# Altium project Pin Swapping - Brendan Cook.PrjPcb (part 1 of 2)
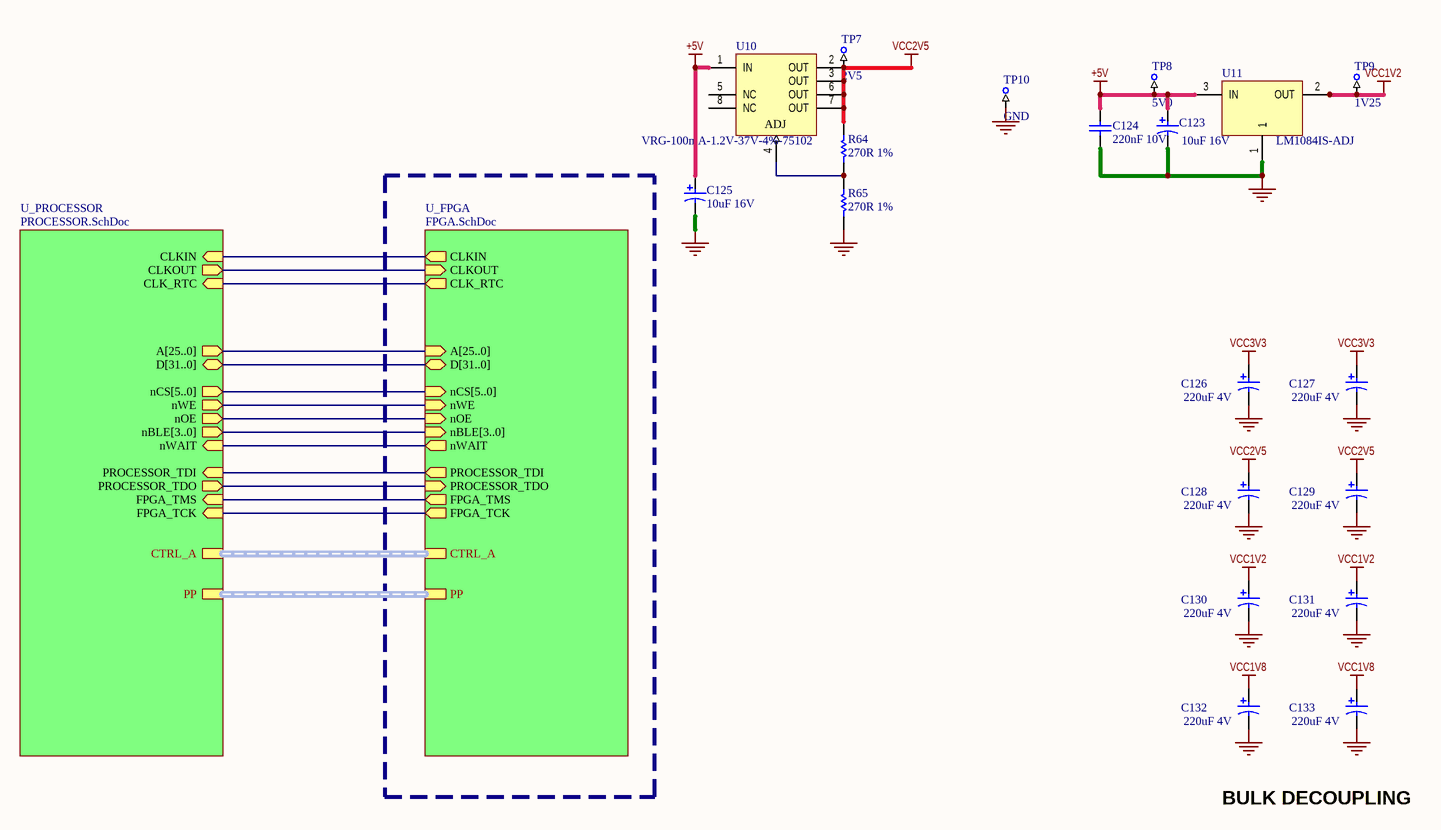
[diagram p0: TOP_SHEET.SchDoc]
5 sheets, 230 parts. Net scope: hierarchical (ports join the sheet entries above them; power ports are global).
Board file: NBP-28 Pin_Swap_Example.PcbDoc
Sheets:
  TOP_SHEET.SchDoc
    U_PROCESSOR = PROCESSOR.SchDoc
      U_PROCESSOR_MEMORIES = PROCESSOR_MEMORIES.SchDoc
    U_FPGA = FPGA.SchDoc
      U_FPGA_RAM = FPGA_MEMORIES.SchDoc

## Sheet TOP_SHEET.SchDoc: Pin Swapping
size 431 x 279 mm; DocumentNumber: 1; SheetNumber: 1; SheetTotal: 5

### Parts
C123  10uF 16V  [CAPC3528]
C124  220nF 10V  [CAPC1608]
C125  10uF 16V  [CAPC3528]
C126  220uF 4V  [CAPC7343]
C127  220uF 4V  [CAPC7343]
C128  220uF 4V  [CAPC7343]
C129  220uF 4V  [CAPC7343]
C130  220uF 4V  [CAPC7343]
C131  220uF 4V  [CAPC7343]
C132  220uF 4V  [CAPC7343]
C133  220uF 4V  [CAPC7343]
R64  270R 1%  [RESC2012]
R65  270R 1%  [RESC2012]
TP7  2V5  [TestPin]  (no BOM)
TP8  5V0  [TestPin]  (no BOM)
TP9  1V25  [TestPin]  (no BOM)
TP10  GND  [TestPin]  (no BOM)
U10  VRG-100mA-1.2V-37V-4%-75102  [SOP127P600-8]
U11  LM1084IS-ADJ  [TO254P1435-4]

### Sub-sheets
U_FPGA = FPGA.SchDoc: FPGA_TMS (out), FPGA_TCK (out), PROCESSOR_TDO (in), PROCESSOR_TDI (out), CLKIN (out), A[25..0] (in), D[31..0] (bidir), nBLE[3..0] (in), nWE (in), nOE (in), nCS[5..0] (in), nWAIT (out), CLKOUT (in), CLK_RTC (out), PP (harness PP_13_LINES), CTRL_A (harness P_C_HARNESS)
U_PROCESSOR = PROCESSOR.SchDoc: A[25..0] (out), D[31..0] (bidir), CLKOUT (out), PROCESSOR_TDO (out), PROCESSOR_TDI (in), nBLE[3..0] (out), nWE (out), nOE (out), nCS[5..0] (out), nWAIT (in), CLKIN (in), FPGA_TMS (in), FPGA_TCK (in), CLK_RTC (in), PP (harness PP_13_LINES), CTRL_A (harness P_C_HARNESS)

### Nets
+5V: C123.1 C124.1 C125.1 TP8.1 U10.1(IN) U11.3(IN)
GND: C123.2 C124.2 C125.2 C126.2 C127.2 C128.2 C129.2 C130.2 C131.2 C132.2 C133.2 R65.2 TP10.1 U11.1
VCC1V2: C130.1 C131.1 TP9.1 U11.2(OUT) U11.4(HeatSink)
VCC1V8: C132.1 C133.1
VCC2V5: C128.1 C129.1 R64.1 TP7.1 U10.2(OUT) U10.3(OUT) U10.6(OUT) U10.7(OUT)
VCC3V3: C126.1 C127.1
CLK_RTC: sheet U_PROCESSOR/CLK_RTC, sheet U_FPGA/CLK_RTC
CLKIN: sheet U_PROCESSOR/CLKIN, sheet U_FPGA/CLKIN
CLKOUT: sheet U_PROCESSOR/CLKOUT, sheet U_FPGA/CLKOUT
FPGA_TCK: sheet U_PROCESSOR/FPGA_TCK, sheet U_FPGA/FPGA_TCK
FPGA_TMS: sheet U_PROCESSOR/FPGA_TMS, sheet U_FPGA/FPGA_TMS
nOE: sheet U_PROCESSOR/nOE, sheet U_FPGA/nOE
nWAIT: sheet U_PROCESSOR/nWAIT, sheet U_FPGA/nWAIT
nWE: sheet U_PROCESSOR/nWE, sheet U_FPGA/nWE
PROCESSOR_TDI: sheet U_PROCESSOR/PROCESSOR_TDI, sheet U_FPGA/PROCESSOR_TDI
PROCESSOR_TDO: sheet U_PROCESSOR/PROCESSOR_TDO, sheet U_FPGA/PROCESSOR_TDO
NetR64_2: R64.2 R65.1 U10.4(ADJ)

Not connected (* = marked no-connect by the designer): U10 5(NC) 8(NC)

### Buses and harness runs
bus sheet U_FPGA/A[25..0] = sheet U_PROCESSOR/A[25..0]
bus sheet U_FPGA/D[31..0] = sheet U_PROCESSOR/D[31..0]
bus sheet U_FPGA/nBLE[3..0] = sheet U_PROCESSOR/nBLE[3..0]
bus sheet U_FPGA/nCS[5..0] = sheet U_PROCESSOR/nCS[5..0]
harness sheet U_FPGA/CTRL_A = sheet U_PROCESSOR/CTRL_A
harness sheet U_FPGA/PP = sheet U_PROCESSOR/PP

### Notes on the sheet
- BULK DECOUPLING
- 8
- 7
- 6
- 5
- 4
- 3
- DWG. NO.
- REV.
- SHT.
- 2
- 1
- THIS DOCUMENT AND THE DATA DISCLOSED HEREIN OR HEREWITH IS THE PROPERTY OF ALTIUM LIMITED AND MAY BE FREELY DISTRIBUTED IN WHOLE. NO RIGHTS ARE RESERVED OR EXPRESS OR IMPLIED WARANTEE GIVEN.
- REVISION
- DESCRIPTION
- DATE
- APPROVED
- F
- E
- D
- C
- B
- ENG:
- APPROVALS
- PROJECT
- A
- DSN:
- CHK:
- REFERENCE DOCUMENTS
- PROJECT REVISION:
- TITLE
- DOCUMENT REVISION:
- DESIGN ITEM:
- BOM:
- FAB DWG:
- PCB DWG:
- ASSY DWG:
- SCALE:
- SIZE
- CAGE CODE
- FILE NAME
- DWG NO.
- SHEET
- OF
- REV

### Library data of the parts
C123 C125-C133 = CAP-P: Polar Capacitor
  C123 C125: Design Item Id: CAP-P-10uF-16V-MCCT-B
  C126-C133: Design Item Id: CAP-P-220uF-4V-MCCT-D
C124 = CAP-NP: Capacitor; Design Item Id: CAP-NP-220nF-10V-0603
R64 R65 = RES: Resistor; Design Item Id: RES-270R-1%-0805
TP7-TP10 = TestPin: Design Item Id: TestPin
U10 = VRG-ADJ-8: Low Current 3-Terminal Adjustable Positive Voltage Regulator; Design Item Id: VRG-100mA-1.2V-37V-4%-75102
U11 = VRG-ADJ-3: 5A Low Dropout Positive Regulators; Design Item Id: LM1084IS-ADJ

## Sheet PROCESSOR.SchDoc: Pin Swapping
size 558 x 431 mm; DocumentNumber: 2; SheetNumber: 2; SheetTotal: 6
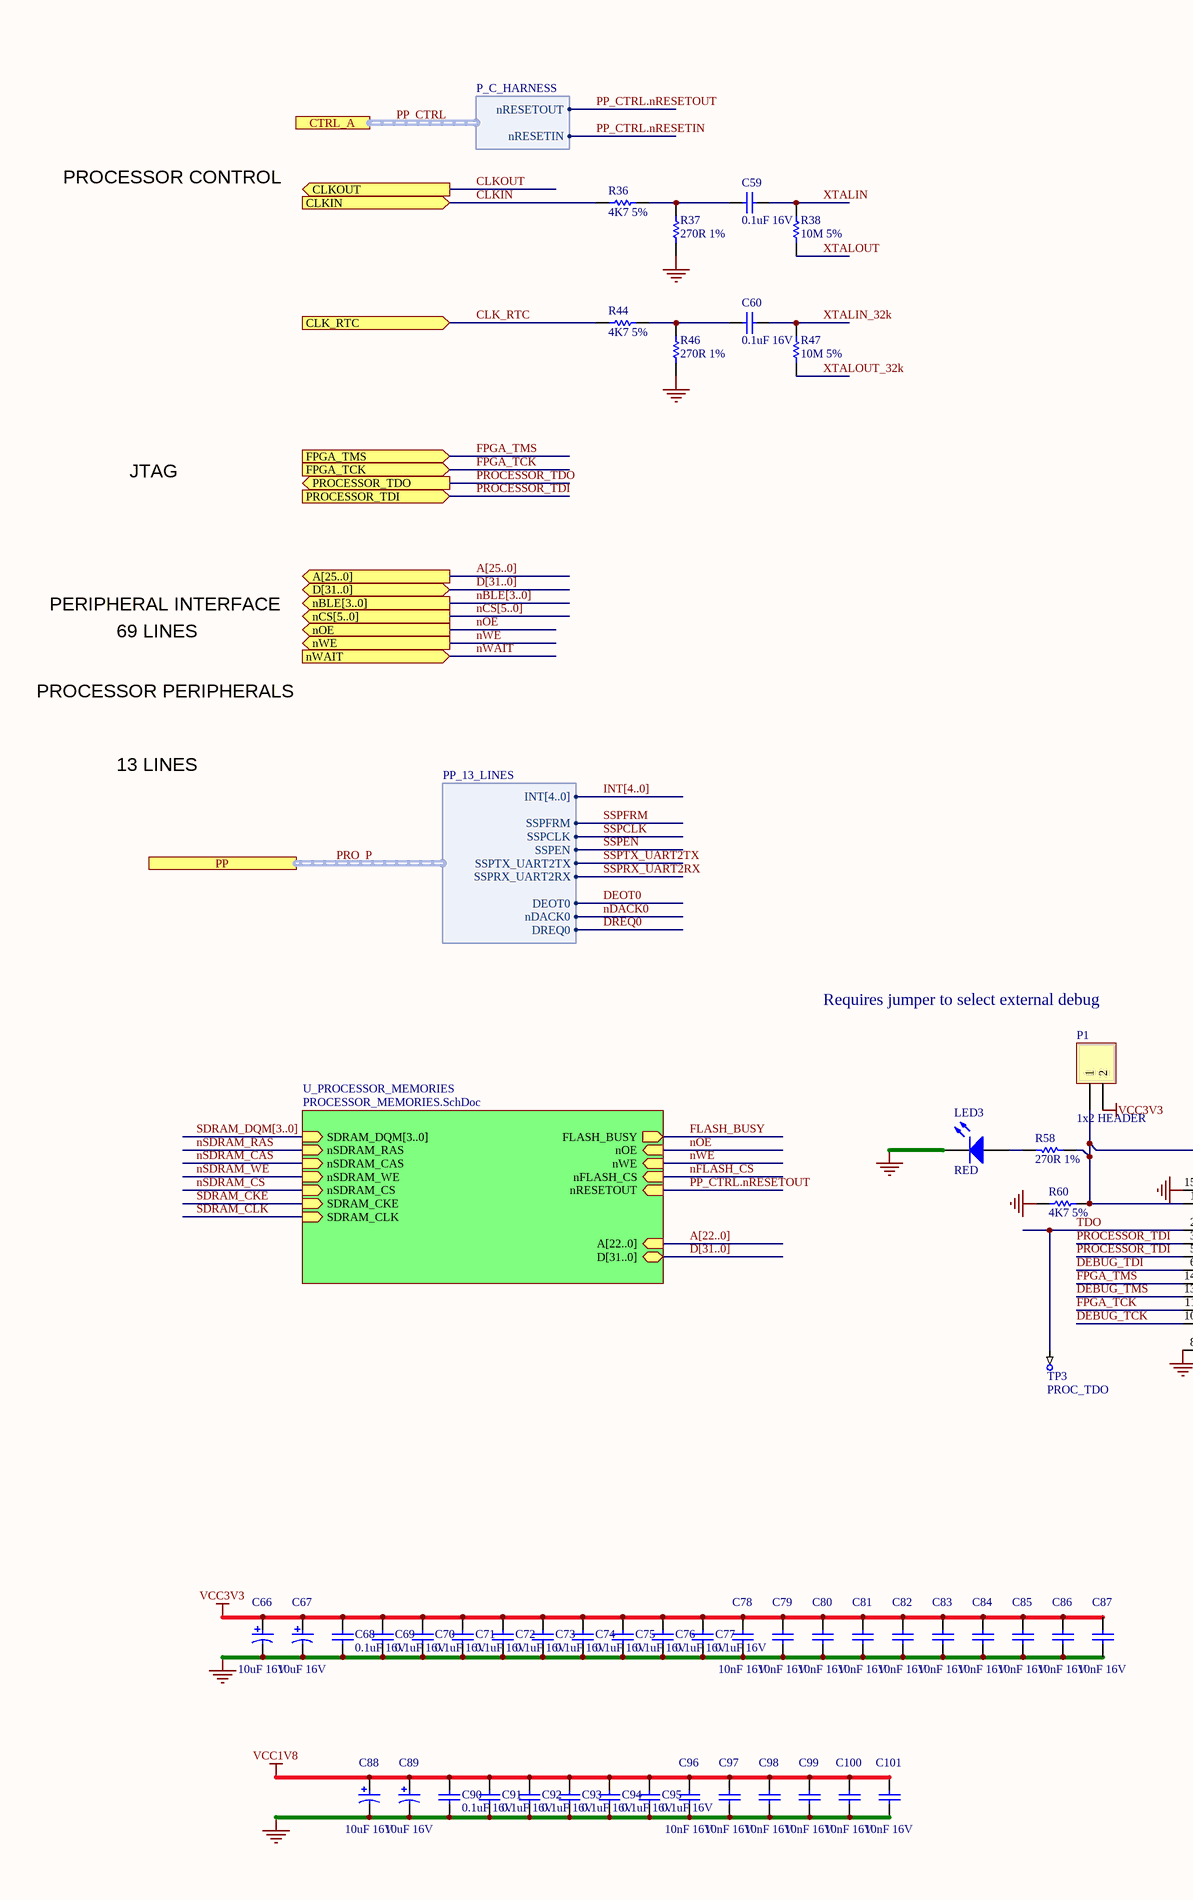
[diagram p1: PROCESSOR.SchDoc, left]
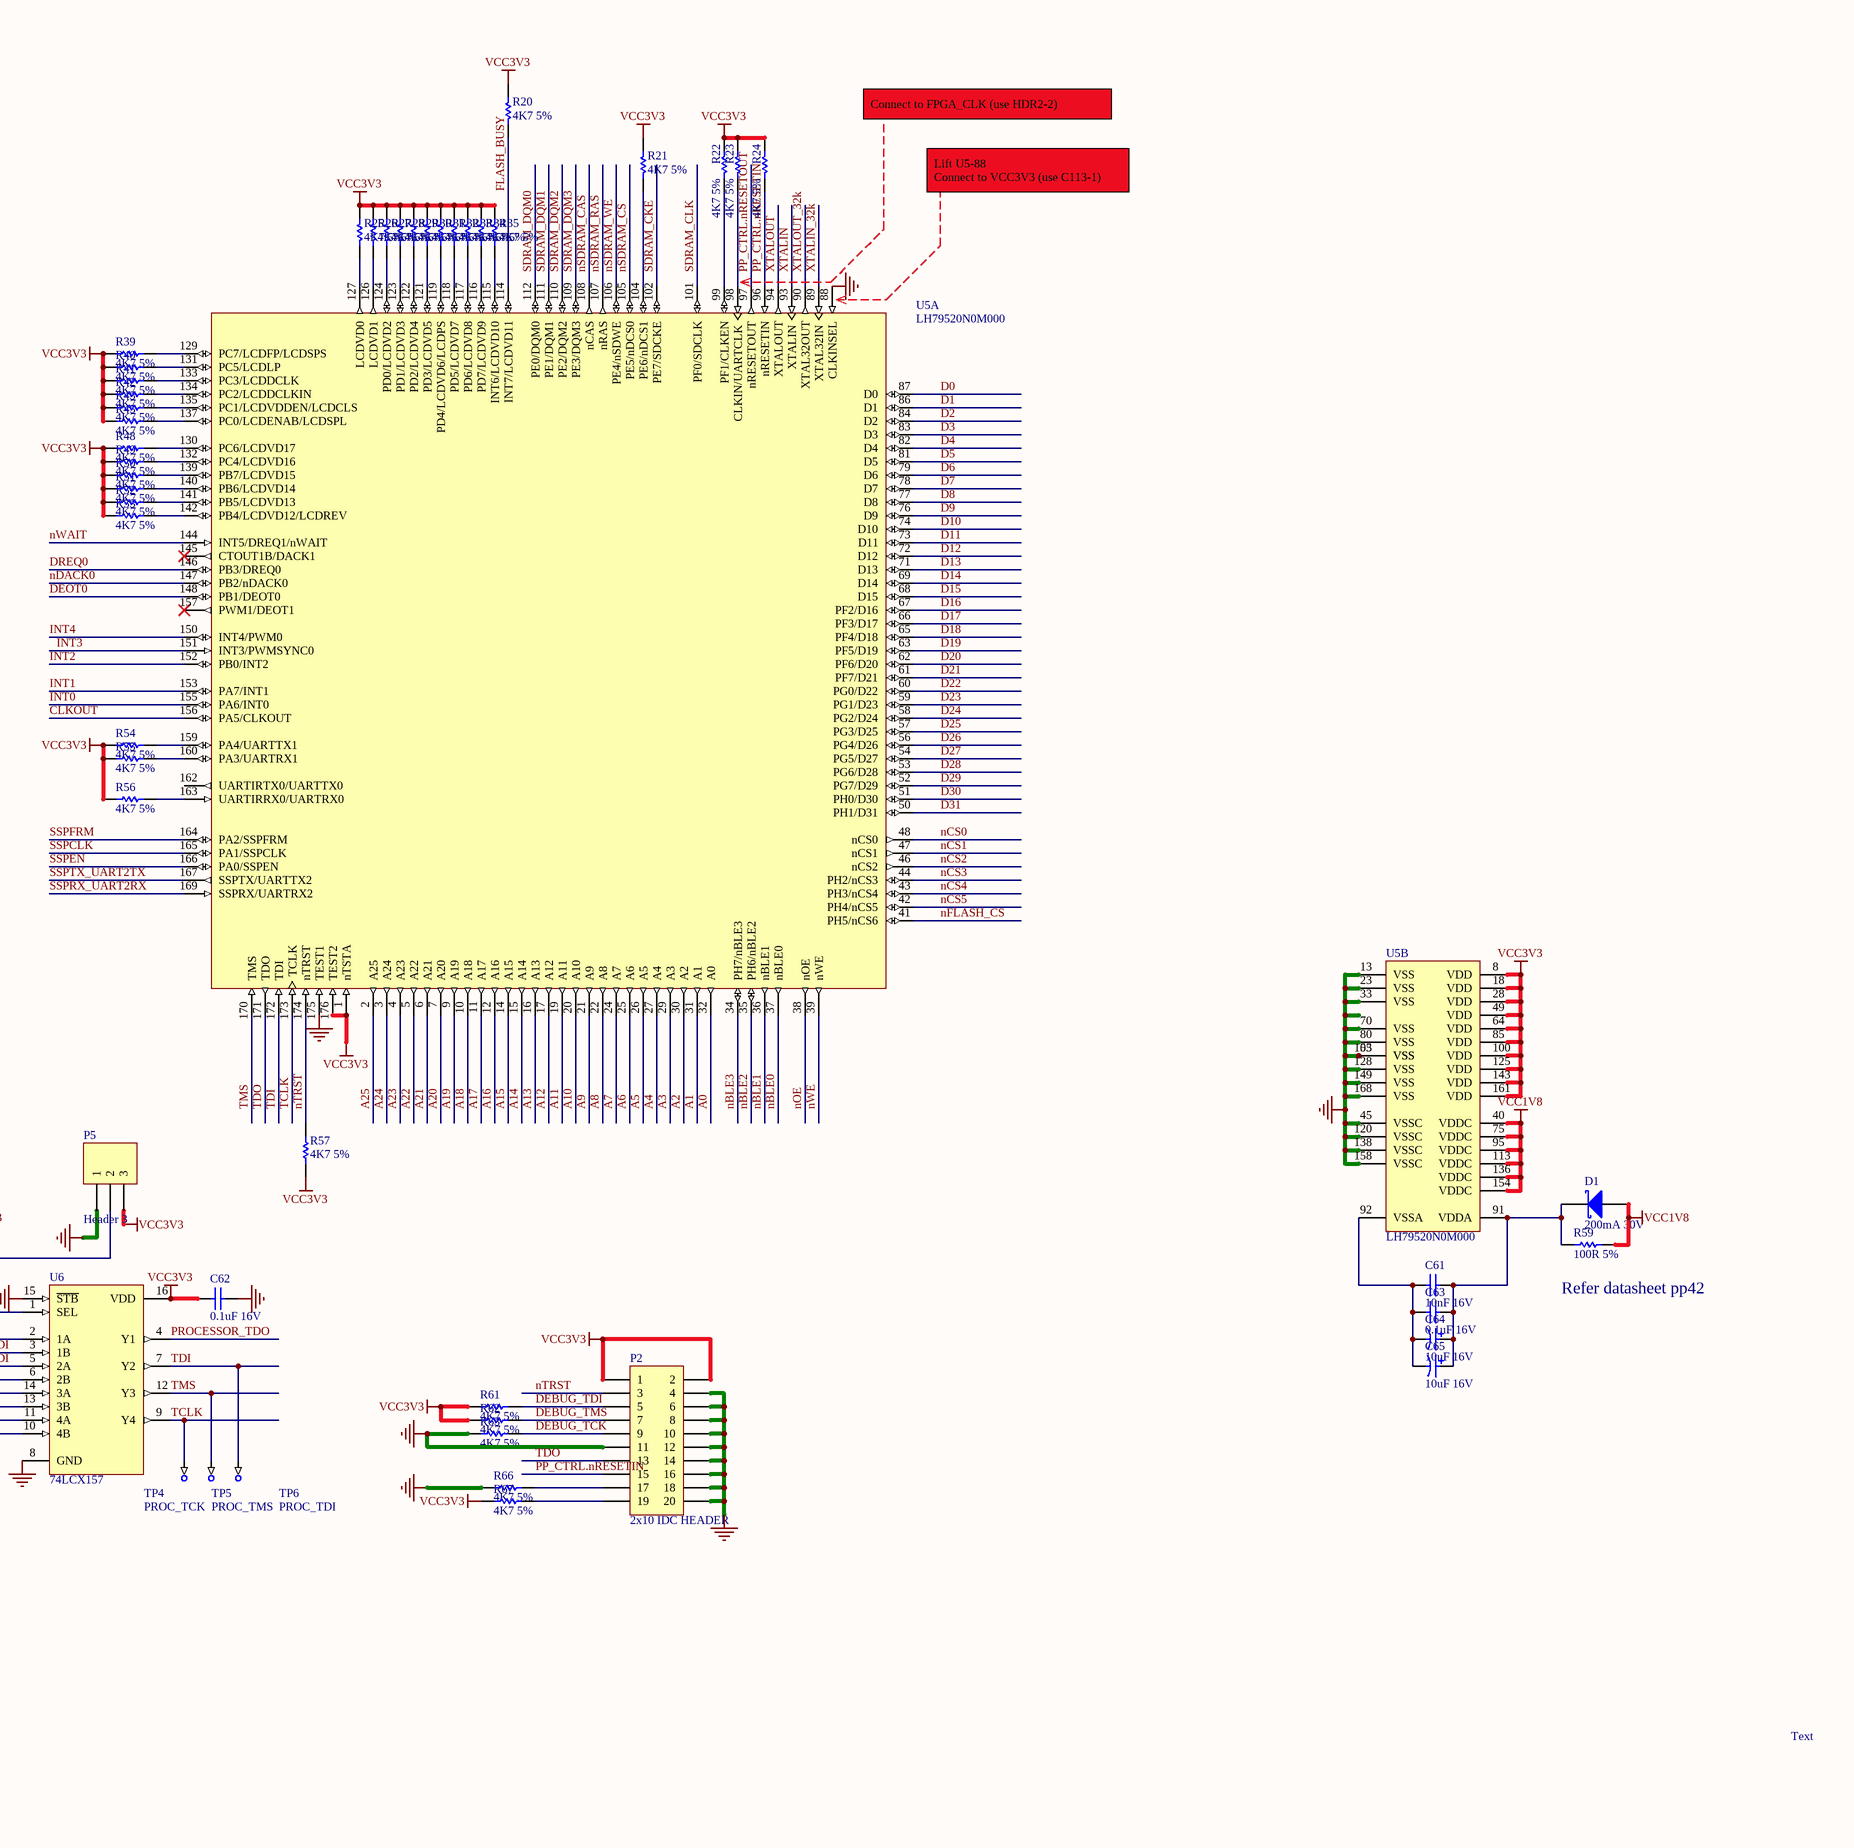
[diagram p2: PROCESSOR.SchDoc, right]

### Parts
C59  0.1uF 16V  [CAPC1005]
C60  0.1uF 16V  [CAPC1005]
C61  10nF 16V  [CAPC1005]
C62  0.1uF 16V  [CAPC1005]
C63  0.1uF 16V  [CAPC1005]
C64  10uF 16V  [CAPC3528]
C65  10uF 16V  [CAPC3528]
C66  10uF 16V  [CAPC3528]
C67  10uF 16V  [CAPC3528]
C68  0.1uF 16V  [CAPC1005]
C69  0.1uF 16V  [CAPC1005]
C70  0.1uF 16V  [CAPC1005]
C71  0.1uF 16V  [CAPC1005]
C72  0.1uF 16V  [CAPC1005]
C73  0.1uF 16V  [CAPC1005]
C74  0.1uF 16V  [CAPC1005]
C75  0.1uF 16V  [CAPC1005]
C76  0.1uF 16V  [CAPC1005]
C77  0.1uF 16V  [CAPC1005]
C78  10nF 16V  [CAPC1005]
C79  10nF 16V  [CAPC1005]
C80  10nF 16V  [CAPC1005]
C81  10nF 16V  [CAPC1005]
C82  10nF 16V  [CAPC1005]
C83  10nF 16V  [CAPC1005]
C84  10nF 16V  [CAPC1005]
C85  10nF 16V  [CAPC1005]
C86  10nF 16V  [CAPC1005]
C87  10nF 16V  [CAPC1005]
C88  10uF 16V  [CAPC3528]
C89  10uF 16V  [CAPC3528]
C90  0.1uF 16V  [CAPC1005]
C91  0.1uF 16V  [CAPC1005]
C92  0.1uF 16V  [CAPC1005]
C93  0.1uF 16V  [CAPC1005]
C94  0.1uF 16V  [CAPC1005]
C95  0.1uF 16V  [CAPC1005]
C96  10nF 16V  [CAPC1005]
C97  10nF 16V  [CAPC1005]
C98  10nF 16V  [CAPC1005]
C99  10nF 16V  [CAPC1005]
C100  10nF 16V  [CAPC1005]
C101  10nF 16V  [CAPC1005]
D1  200mA 30V  [SOT95P230-3]
LED3  RED  [LED2013]
P1  1x2 HEADER  [HDR1X2]
P2  2x10 IDC HEADER  [IDC2.54-V20D]
P5  Header 3  [HDR1X3]
R20  4K7 5%  [RESC1005]
R21  4K7 5%  [RESC1005]
R22  4K7 5%  [RESC1005]
R23  4K7 5%  [RESC1005]
R24  4K7 5%  [RESC1005]
R25  4K7 5%  [RESC1005]
R26  4K7 5%  [RESC1005]
R27  4K7 5%  [RESC1005]
R28  4K7 5%  [RESC1005]
R29  4K7 5%  [RESC1005]
R30  4K7 5%  [RESC1005]
R31  4K7 5%  [RESC1005]
R32  4K7 5%  [RESC1005]
R33  4K7 5%  [RESC1005]
R34  4K7 5%  [RESC1005]
R35  4K7 5%  [RESC1005]
R36  4K7 5%  [RESC1005]
R37  270R 1%  [RESC2012]
R38  10M 5%  [RESC2012]
R39  4K7 5%  [RESC1005]
R40  4K7 5%  [RESC1005]
R41  4K7 5%  [RESC1005]
R42  4K7 5%  [RESC1005]
R43  4K7 5%  [RESC1005]
R44  4K7 5%  [RESC1005]
R45  4K7 5%  [RESC1005]
R46  270R 1%  [RESC2012]
R47  10M 5%  [RESC2012]
R48  4K7 5%  [RESC1005]
R49  4K7 5%  [RESC1005]
R50  4K7 5%  [RESC1005]
R51  4K7 5%  [RESC1005]
R52  4K7 5%  [RESC1005]
R53  4K7 5%  [RESC1005]
R54  4K7 5%  [RESC1005]
R55  4K7 5%  [RESC1005]
R56  4K7 5%  [RESC1005]
R57  4K7 5%  [RESC1005]
R58  270R 1%  [RESC2012]
R59  100R 5%  [RESC2012]
R60  4K7 5%  [RESC1005]
R61  4K7 5%  [RESC1005]
R62  4K7 5%  [RESC1005]
R63  4K7 5%  [RESC1005]
R66  4K7 5%  [RESC1005]
R67  4K7 5%  [RESC1005]
TP3  PROC_TDO  [TestPin]  (no BOM)
TP4  PROC_TCK  [TestPin]  (no BOM)
TP5  PROC_TMS  [TestPin]  (no BOM)
TP6  PROC_TDI  [TestPin]  (no BOM)
U5  LH79520N0M000  [QFP40P2000X2000-176]  (parts A,B of 2)
U6  74LCX157  [TSOP65P638-16]

### Sub-sheets
U_PROCESSOR_MEMORIES = PROCESSOR_MEMORIES.SchDoc: SDRAM_DQM[3..0] (in), nSDRAM_RAS (in), nSDRAM_CAS (in), nSDRAM_WE (in), nSDRAM_CS (in), SDRAM_CKE (in), SDRAM_CLK (in), A[22..0] (in), D[31..0] (bidir), nOE (in), nWE (in), nFLASH_CS (in), nRESETOUT (in), FLASH_BUSY (out)

### Ports
A[25..0] (out), CLK_RTC (in), CLKIN (in), CLKOUT (out), CTRL_A (harness P_C_HARNESS), D[31..0] (bidir), FPGA_TCK (in), FPGA_TMS (in), nBLE[3..0] (out), nCS[5..0] (out), nOE (out), nWAIT (in), nWE (out), PP (harness PP_13_LINES), PROCESSOR_TDI (in), PROCESSOR_TDO (out)

### Harnesses
PP_13_LINES: INT[4..0], SSPFRM, SSPCLK, SSPEN, SSPTX_UART2TX, SSPRX_UART2RX, DEOT0, nDACK0, DREQ0
P_C_HARNESS: nRESETOUT, nRESETIN

### Nets
GND: C62.2 C66.2 C67.2 C68.2 C69.2 C70.2 C71.2 C72.2 C73.2 C74.2 C75.2 C76.2 C77.2 C78.2 C79.2 C80.2 C81.2 C82.2 C83.2 C84.2 C85.2 C86.2 C87.2 C88.2 C89.2 C90.2 C91.2 C92.2 C93.2 C94.2 C95.2 C96.2 C97.2 C98.2 C99.2 C100.2 C101.2 LED3.2(K) P2.4 P2.6 P2.8 P2.10 P2.11 P2.12 P2.14 P2.16 P2.18 P2.20 P5.1 R37.1 R46.1 R60.2 R63.1 R66.1 U5.13(VSS) U5.23(VSS) U5.33(VSS) U5.45(VSSC) U5.55(VSS) U5.70(VSS) U5.80(VSS) U5.88(CLKINSEL) U5.103(VSS) U5.120(VSSC) U5.128(VSS) U5.138(VSSC) U5.149(VSS) U5.158(VSSC) U5.168(VSS) U5.175(TEST1) U6.8(GND) U6.15(~{STB})
VCC1V8: C88.1 C89.1 C90.1 C91.1 C92.1 C93.1 C94.1 C95.1 C96.1 C97.1 C98.1 C99.1 C100.1 C101.1 D1.1(A) R59.1 U5.40(VDDC) U5.75(VDDC) U5.95(VDDC) U5.113(VDDC) U5.136(VDDC) U5.154(VDDC)
VCC3V3: C62.1 C66.1 C67.1 C68.1 C69.1 C70.1 C71.1 C72.1 C73.1 C74.1 C75.1 C76.1 C77.1 C78.1 C79.1 C80.1 C81.1 C82.1 C83.1 C84.1 C85.1 C86.1 C87.1 P1.2 P2.1 P2.2 P5.3 R20.2 R21.2 R22.2 R23.2 R24.2 R25.2 R26.2 R27.2 R28.2 R29.2 R30.2 R31.2 R32.2 R33.2 R34.2 R35.2 R39.2 R40.2 R41.2 R42.2 R43.2 R45.2 R48.2 R49.2 R50.2 R51.2 R52.2 R53.2 R54.2 R55.2 R56.2 R57.2 R61.1 R62.1 R67.1 U5.1(nTSTA) U5.8(VDD) U5.18(VDD) U5.28(VDD) U5.49(VDD) U5.64(VDD) U5.85(VDD) U5.100(VDD) U5.125(VDD) U5.143(VDD) U5.161(VDD) U5.176(TEST2) U6.16(VDD)
A0: U5.32(A0)
A1: U5.31(A1)
A2: U5.30(A2)
A3: U5.29(A3)
A4: U5.27(A4)
A5: U5.26(A5)
A6: U5.25(A6)
A7: U5.24(A7)
A8: U5.22(A8)
A9: U5.21(A9)
A10: U5.20(A10)
A11: U5.19(A11)
A12: U5.17(A12)
A13: U5.16(A13)
A14: U5.15(A14)
A15: U5.14(A15)
A16: U5.12(A16)
A17: U5.11(A17)
A18: U5.10(A18)
A19: U5.9(A19)
A20: U5.7(A20)
A21: U5.6(A21)
A22: U5.5(A22)
A23: U5.4(A23)
A24: U5.3(A24)
A25: U5.2(A25)
CLK_RTC: R44.2 ; port CLK_RTC
CLKIN: R36.2 ; port CLKIN
CLKOUT: U5.156(PA5/CLKOUT) ; port CLKOUT
D0: U5.87(D0)
D1: U5.86(D1)
D2: U5.84(D2)
D3: U5.83(D3)
D4: U5.82(D4)
D5: U5.81(D5)
D6: U5.79(D6)
D7: U5.78(D7)
D8: U5.77(D8)
D9: U5.76(D9)
D10: U5.74(D10)
D11: U5.73(D11)
D12: U5.72(D12)
D13: U5.71(D13)
D14: U5.69(D14)
D15: U5.68(D15)
D16: U5.67(PF2/D16)
D17: U5.66(PF3/D17)
D18: U5.65(PF4/D18)
D19: U5.63(PF5/D19)
D20: U5.62(PF6/D20)
D21: U5.61(PF7/D21)
D22: U5.60(PG0/D22)
D23: U5.59(PG1/D23)
D24: U5.58(PG2/D24)
D25: U5.57(PG3/D25)
D26: U5.56(PG4/D26)
D27: U5.54(PG5/D27)
D28: U5.53(PG6/D28)
D29: U5.52(PG7/D29)
D30: U5.51(PH0/D30)
D31: U5.50(PH1/D31)
DEBUG_TCK: P2.9 R63.2 U6.10(4B)
DEBUG_TDI: P2.5 R61.2 U6.6(2B)
DEBUG_TMS: P2.7 R62.2 U6.13(3B)
DEOT0: U5.148(PB1/DEOT0) ; port PP.DEOT0
DREQ0: U5.146(PB3/DREQ0) ; port PP.DREQ0
FLASH_BUSY: R20.1 U5.114(INT7/LCDVD11) ; sheet U_PROCESSOR_MEMORIES/FLASH_BUSY
FPGA_TCK: U6.11(4A) ; port FPGA_TCK
FPGA_TMS: U6.14(3A) ; port FPGA_TMS
INT0: U5.155(PA6/INT0)
INT1: U5.153(PA7/INT1)
INT2: U5.152(PB0/INT2)
INT3: U5.151(INT3/PWMSYNC0)
INT4: U5.150(INT4/PWM0)
nBLE0: U5.37(nBLE0)
nBLE1: U5.36(nBLE1)
nBLE2: U5.35(PH6/nBLE2)
nBLE3: U5.34(PH7/nBLE3)
nCS0: U5.48(nCS0)
nCS1: U5.47(nCS1)
nCS2: U5.46(nCS2)
nCS3: U5.44(PH2/nCS3)
nCS4: U5.43(PH3/nCS4)
nCS5: U5.42(PH4/nCS5)
nDACK0: U5.147(PB2/nDACK0) ; port PP.nDACK0
nFLASH_CS: U5.41(PH5/nCS6) ; sheet U_PROCESSOR_MEMORIES/nFLASH_CS
nOE: U5.38(nOE) ; port nOE, sheet U_PROCESSOR_MEMORIES/nOE
nSDRAM_CAS: U5.108(nCAS) ; sheet U_PROCESSOR_MEMORIES/nSDRAM_CAS
nSDRAM_CS: U5.105(PE5/nDCS0) ; sheet U_PROCESSOR_MEMORIES/nSDRAM_CS
nSDRAM_RAS: U5.107(nRAS) ; sheet U_PROCESSOR_MEMORIES/nSDRAM_RAS
nSDRAM_WE: U5.106(PE4/nSDWE) ; sheet U_PROCESSOR_MEMORIES/nSDRAM_WE
nTRST: P2.3 R57.1 U5.174(nTRST)
nWAIT: U5.144(INT5/DREQ1/nWAIT) ; port nWAIT
nWE: U5.39(nWE) ; port nWE, sheet U_PROCESSOR_MEMORIES/nWE
PP_CTRL.nRESETIN: P2.15 R24.1 U5.96(nRESETIN) ; port CTRL_A.nRESETIN
PP_CTRL.nRESETOUT: U5.97(nRESETOUT) ; sheet U_PROCESSOR_MEMORIES/nRESETOUT, port CTRL_A.nRESETOUT  [project net nRESETOUT]
PROCESSOR_TDI: U6.3(1B) U6.5(2A) ; port PROCESSOR_TDI
PROCESSOR_TDO: U6.4(Y1) ; port PROCESSOR_TDO
SDRAM_CKE: U5.102(PE7/SDCKE) ; sheet U_PROCESSOR_MEMORIES/SDRAM_CKE
SDRAM_CLK: U5.101(PF0/SDCLK) ; sheet U_PROCESSOR_MEMORIES/SDRAM_CLK
SDRAM_DQM0: U5.112(PE0/DQM0)
SDRAM_DQM1: U5.111(PE1/DQM1)
SDRAM_DQM2: U5.110(PE2/DQM2)
SDRAM_DQM3: U5.109(PE3/DQM3)
SSPCLK: U5.165(PA1/SSPCLK) ; port PP.SSPCLK  [project net PRO_P.SSPCLK]
SSPEN: U5.166(PA0/SSPEN) ; port PP.SSPEN  [project net PRO_P.SSPEN]
SSPFRM: U5.164(PA2/SSPFRM) ; port PP.SSPFRM  [project net PRO_P.SSPFRM]
SSPRX_UART2RX: U5.169(SSPRX/UARTRX2) ; port PP.SSPRX_UART2RX  [project net PRO_P.SSPRX_UART2RX]
SSPTX_UART2TX: U5.167(SSPTX/UARTTX2) ; port PP.SSPTX_UART2TX  [project net PRO_P.SSPTX_UART2TX]
TCLK: TP4.1 U5.173(TCLK) U6.9(Y4)
TDI: TP6.1 U5.172(TDI) U6.7(Y2)
TDO: P2.13 TP3.1 U5.171(TDO) U6.2(1A)
TMS: TP5.1 U5.170(TMS) U6.12(Y3)
XTALIN: C59.2 R38.1 U5.93(XTALIN)
XTALIN_32k: C60.2 R47.1 U5.89(XTAL32IN)
XTALOUT: R38.2 U5.94(XTALOUT)
XTALOUT_32k: R47.2 U5.90(XTAL32OUT)
NetC59_1: C59.1 R36.1 R37.2
NetC60_1: C60.1 R44.1 R46.2
NetC61_1: C61.1 C63.1 C64.1 C65.1 D1.3(k) R59.2 U5.91(VDDA)
NetC61_2: C61.2 C63.2 C64.2 C65.2 U5.92(VSSA)
NetLED3_1: LED3.1(A) R58.2
NetP1_1: P1.1 P5.2 R58.1 R60.1 U6.1(SEL)
NetP2_17: P2.17 R66.2
NetP2_19: P2.19 R67.2
NetR21_1: R21.1 U5.104(PE6/nDCS1)
NetR22_1: R22.1 U5.99(PF1/CLKEN)
NetR23_1: R23.1 U5.98(CLKIN/UARTCLK)
NetR25_1: R25.1 U5.127(LCDVD0)
NetR26_1: R26.1 U5.126(LCDVD1)
NetR27_1: R27.1 U5.124(PD0/LCDVD2)
NetR28_1: R28.1 U5.123(PD1/LCDVD3)
NetR29_1: R29.1 U5.122(PD2/LCDVD4)
NetR30_1: R30.1 U5.121(PD3/LCDVD5)
NetR31_1: R31.1 U5.119(PD4/LCDVD6/LCDPS)
NetR32_1: R32.1 U5.118(PD5/LCDVD7)
NetR33_1: R33.1 U5.117(PD6/LCDVD8)
NetR34_1: R34.1 U5.116(PD7/LCDVD9)
NetR35_1: R35.1 U5.115(INT6/LCDVD10)
NetR39_1: R39.1 U5.129(PC7/LCDFP/LCDSPS)
NetR40_1: R40.1 U5.131(PC5/LCDLP)
NetR41_1: R41.1 U5.133(PC3/LCDDCLK)
NetR42_1: R42.1 U5.134(PC2/LCDDCLKIN)
NetR43_1: R43.1 U5.135(PC1/LCDVDDEN/LCDCLS)
NetR45_1: R45.1 U5.137(PC0/LCDENAB/LCDSPL)
NetR48_1: R48.1 U5.130(PC6/LCDVD17)
NetR49_1: R49.1 U5.132(PC4/LCDVD16)
NetR50_1: R50.1 U5.139(PB7/LCDVD15)
NetR51_1: R51.1 U5.140(PB6/LCDVD14)
NetR52_1: R52.1 U5.141(PB5/LCDVD13)
NetR53_1: R53.1 U5.142(PB4/LCDVD12/LCDREV)
NetR54_1: R54.1 U5.159(PA4/UARTTX1)
NetR55_1: R55.1 U5.160(PA3/UARTRX1)
NetR56_1: R56.1 U5.163(UARTIRRX0/UARTRX0)

Not connected (* = marked no-connect by the designer): D1 2; U5 145(CTOUT1B/DACK1)* 157(PWM1/DEOT1)* 162(UARTIRTX0/UARTTX0)

### Buses and harness runs
bus A[22..0] = sheet U_PROCESSOR_MEMORIES/A[22..0]
bus A[25..0] = port A[25..0]
bus D[31..0] = port D[31..0]
bus D[31..0] = sheet U_PROCESSOR_MEMORIES/D[31..0]
bus INT[4..0]
bus nBLE[3..0] = port nBLE[3..0]
bus nCS[5..0] = port nCS[5..0]
bus SDRAM_DQM[3..0] = sheet U_PROCESSOR_MEMORIES/SDRAM_DQM[3..0]
harness PP_CTRL = port CTRL_A
harness PRO_P = port PP

### Notes on the sheet
- Connect to FPGA_CLK (use HDR2-2)
- Lift U5-88
  Connect to VCC3V3 (use C113-1)
- PROCESSOR CONTROL
- JTAG
- PERIPHERAL INTERFACE
- 69 LINES
- PROCESSOR PERIPHERALS
- 13 LINES
- Requires jumper to select external debug
- (near R59) Refer datasheet pp42
- Text
- 10
- 9
- 8
- 7
- 6
- 5
- 4
- 3
- DWG. NO.
- 2
- 1
- REV.
- SHT.
- REVISION
- DESCRIPTION
- DATE
- APPROVED
- H
- THIS DOCUMENT AND THE DATA DISCLOSED HEREIN OR HEREWITH IS THE PROPERTY OF ALTIUM LIMITED AND MAY BE FREELY DISTRIBUTED IN WHOLE. NO RIGHTS ARE RESERVED OR EXPRESS OR IMPLIED WARANTEE GIVEN.
- G
- F
- E
- D
- C
- B
- A
- TITLE
- SCALE:
- SIZE
- CAGE CODE
- FILE NAME
- DWG NO.
- SHEET
- OF
- REV

### Library data of the parts
C59-C63 C68-C87 C90-C101 = CAP-NP: Capacitor
  C59 C60 C62 C63 C68-C77 C90-C95: Design Item Id: CAP-NP-0.1uF-16V-0402
  C61 C78-C87 C96-C101: Design Item Id: CAP-NP-10nF-16V-0402
C64-C67 C88 C89 = CAP-P: Polar Capacitor; Design Item Id: CAP-P-10uF-16V-MCCT-B
D1 = DIO-SCHOTTKY-1S-SOT23: Schottky Barrier Double Diode; Design Item Id: DIO-SCHOTTKY-1S-SOT23
LED3 = DIO-LED-1S: Typical GREEN SMD LED Agilent make; Design Item Id: LED-RED-HSMHC170
P1 = CON-HDR-1x2-STR: Header, 2-Pin; Design Item Id: CON-HDRSTR-2x1-2.54mm
P2 = CON-IDC-2x10-M-STR: 10x2 IDC Male PCB Box Header; Design Item Id: CON-IDCHDRSTRBOX-M-20
P5 = Header 3: Header, 3-Pin; LatestRevisionDate: 17-Jul-2002; LatestRevisionNote: Re-released for DXP Platform.; Publisher: Altium Limited
R20-R63 R66 R67 = RES: Resistor
  R20-R36 R39-R45 R48-R57 R60-R63 R66 R67: Design Item Id: RES-4K7-0402
  R37 R46 R58: Design Item Id: RES-270R-1%-0805
  R38 R47: Design Item Id: RES-10M-0805
  R59: Design Item Id: RES-100R-0805
TP3-TP6 = TestPin: Design Item Id: TestPin
U5 = LH79520N0M000: 32-Bit ARM720T-Based BlueStreak MCU with 8KB Cache, MMU, Color LCD controller, 32KB SRAM, 176-Pin LQFP; Design Item Id: LH79520N0M000
U6 = 74LCX157-TSOP16: Quad 2-Input Multiplexer; Design Item Id: 74LCX157-TSOP16

## Sheet PROCESSOR_MEMORIES.SchDoc: Pin Swapping
size 431 x 279 mm; DocumentNumber: 3; SheetNumber: 3; SheetTotal: 6
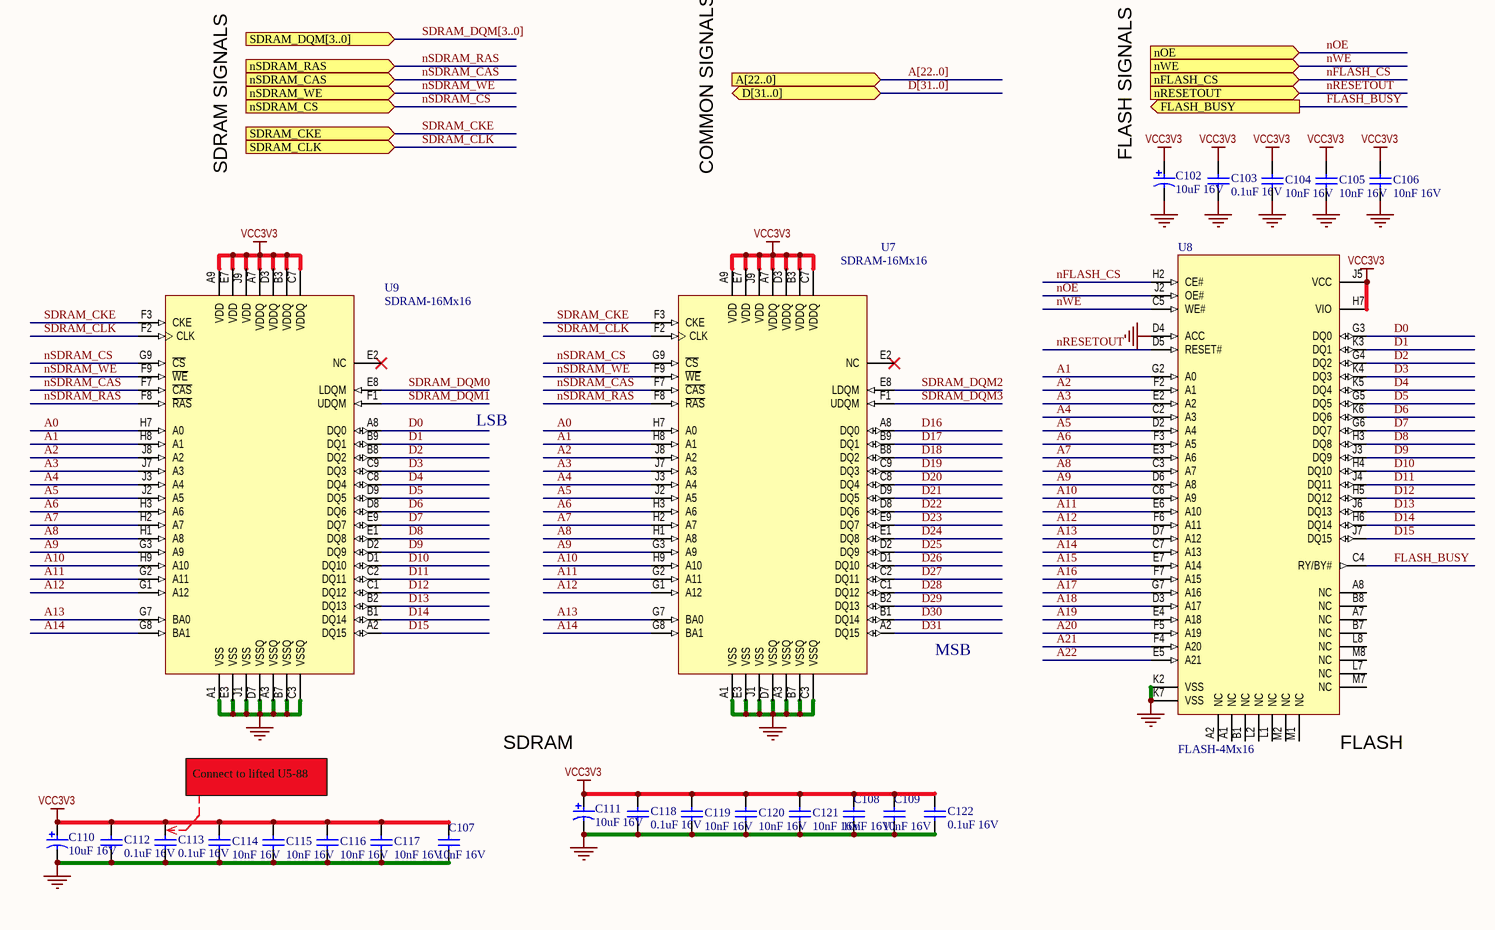
[diagram p3: PROCESSOR_MEMORIES.SchDoc]

### Parts
C102  10uF 16V  [CAPC3528]
C103  0.1uF 16V  [CAPC1005]
C104  10nF 16V  [CAPC1005]
C105  10nF 16V  [CAPC1005]
C106  10nF 16V  [CAPC1005]
C107  10nF 16V  [CAPC1005]
C108  10nF 16V  [CAPC1005]
C109  10nF 16V  [CAPC1005]
C110  10uF 16V  [CAPC3528]
C111  10uF 16V  [CAPC3528]
C112  0.1uF 16V  [CAPC1005]
C113  0.1uF 16V  [CAPC1005]
C114  10nF 16V  [CAPC1005]
C115  10nF 16V  [CAPC1005]
C116  10nF 16V  [CAPC1005]
C117  10nF 16V  [CAPC1005]
C118  0.1uF 16V  [CAPC1005]
C119  10nF 16V  [CAPC1005]
C120  10nF 16V  [CAPC1005]
C121  10nF 16V  [CAPC1005]
C122  0.1uF 16V  [CAPC1005]
U7  SDRAM-16Mx16  [BGA80P9X6-54]
U8  FLASH-4Mx16  [BGA80P12X8-63]
U9  SDRAM-16Mx16  [BGA80P9X6-54]

### Ports
A[22..0] (in), D[31..0] (bidir), FLASH_BUSY (out), nFLASH_CS (in), nOE (in), nRESETOUT (in), nSDRAM_CAS (in), nSDRAM_CS (in), nSDRAM_RAS (in), nSDRAM_WE (in), nWE (in), SDRAM_CKE (in), SDRAM_CLK (in), SDRAM_DQM[3..0] (in)

### Nets
GND: C102.2 C103.2 C104.2 C105.2 C106.2 C107.2 C108.2 C109.2 C110.2 C111.2 C112.2 C113.2 C114.2 C115.2 C116.2 C117.2 C118.2 C119.2 C120.2 C121.2 C122.2 U7.A1(VSS) U7.A3(VSSQ) U7.B7(VSSQ) U7.C3(VSSQ) U7.D7(VSSQ) U7.E3(VSS) U7.J1(VSS) U8.D4(ACC) U8.K2(VSS) U8.K7(VSS) U9.A1(VSS) U9.A3(VSSQ) U9.B7(VSSQ) U9.C3(VSSQ) U9.D7(VSSQ) U9.E3(VSS) U9.J1(VSS)
VCC3V3: C102.1 C103.1 C104.1 C105.1 C106.1 C107.1 C108.1 C109.1 C110.1 C111.1 C112.1 C113.1 C114.1 C115.1 C116.1 C117.1 C118.1 C119.1 C120.1 C121.1 C122.1 U7.A7(VDDQ) U7.A9(VDD) U7.B3(VDDQ) U7.C7(VDDQ) U7.D3(VDDQ) U7.E7(VDD) U7.J9(VDD) U8.H7(VIO) U8.J5(VCC) U9.A7(VDDQ) U9.A9(VDD) U9.B3(VDDQ) U9.C7(VDDQ) U9.D3(VDDQ) U9.E7(VDD) U9.J9(VDD)
A0: U7.H7(A0) U9.H7(A0)
A1: U7.H8(A1) U8.G2(A0) U9.H8(A1)
A2: U7.J8(A2) U8.F2(A1) U9.J8(A2)
A3: U7.J7(A3) U8.E2(A2) U9.J7(A3)
A4: U7.J3(A4) U8.C2(A3) U9.J3(A4)
A5: U7.J2(A5) U8.D2(A4) U9.J2(A5)
A6: U7.H3(A6) U8.F3(A5) U9.H3(A6)
A7: U7.H2(A7) U8.E3(A6) U9.H2(A7)
A8: U7.H1(A8) U8.C3(A7) U9.H1(A8)
A9: U7.G3(A9) U8.D6(A8) U9.G3(A9)
A10: U7.H9(A10) U8.C6(A9) U9.H9(A10)
A11: U7.G2(A11) U8.E6(A10) U9.G2(A11)
A12: U7.G1(A12) U8.F6(A11) U9.G1(A12)
A13: U7.G7(BA0) U8.D7(A12) U9.G7(BA0)
A14: U7.G8(BA1) U8.C7(A13) U9.G8(BA1)
A15: U8.E7(A14)
A16: U8.F7(A15)
A17: U8.G7(A16)
A18: U8.D3(A17)
A19: U8.E4(A18)
A20: U8.F5(A19)
A21: U8.F4(A20)
A22: U8.E5(A21)
D0: U8.G3(DQ0) U9.A8(DQ0)
D1: U8.K3(DQ1) U9.B9(DQ1)
D2: U8.G4(DQ2) U9.B8(DQ2)
D3: U8.K4(DQ3) U9.C9(DQ3)
D4: U8.K5(DQ4) U9.C8(DQ4)
D5: U8.G5(DQ5) U9.D9(DQ5)
D6: U8.K6(DQ6) U9.D8(DQ6)
D7: U8.G6(DQ7) U9.E9(DQ7)
D8: U8.H3(DQ8) U9.E1(DQ8)
D9: U8.J3(DQ9) U9.D2(DQ9)
D10: U8.H4(DQ10) U9.D1(DQ10)
D11: U8.J4(DQ11) U9.C2(DQ11)
D12: U8.H5(DQ12) U9.C1(DQ12)
D13: U8.J6(DQ13) U9.B2(DQ13)
D14: U8.H6(DQ14) U9.B1(DQ14)
D15: U8.J7(DQ15) U9.A2(DQ15)
D16: U7.A8(DQ0)
D17: U7.B9(DQ1)
D18: U7.B8(DQ2)
D19: U7.C9(DQ3)
D20: U7.C8(DQ4)
D21: U7.D9(DQ5)
D22: U7.D8(DQ6)
D23: U7.E9(DQ7)
D24: U7.E1(DQ8)
D25: U7.D2(DQ9)
D26: U7.D1(DQ10)
D27: U7.C2(DQ11)
D28: U7.C1(DQ12)
D29: U7.B2(DQ13)
D30: U7.B1(DQ14)
D31: U7.A2(DQ15)
FLASH_BUSY: U8.C4(RY/BY#) ; port FLASH_BUSY
nFLASH_CS: U8.H2(CE#) ; port nFLASH_CS
nOE: U8.J2(OE#) ; port nOE
nRESETOUT: U8.D5(RESET#) ; port nRESETOUT
nSDRAM_CAS: U7.F7(~{CAS}) U9.F7(~{CAS}) ; port nSDRAM_CAS
nSDRAM_CS: U7.G9(~{CS}) U9.G9(~{CS}) ; port nSDRAM_CS
nSDRAM_RAS: U7.F8(~{RAS}) U9.F8(~{RAS}) ; port nSDRAM_RAS
nSDRAM_WE: U7.F9(~{WE}) U9.F9(~{WE}) ; port nSDRAM_WE
nWE: U8.C5(WE#) ; port nWE
SDRAM_CKE: U7.F3(CKE) U9.F3(CKE) ; port SDRAM_CKE
SDRAM_CLK: U7.F2(CLK) U9.F2(CLK) ; port SDRAM_CLK
SDRAM_DQM0: U9.E8(LDQM)
SDRAM_DQM1: U9.F1(UDQM)
SDRAM_DQM2: U7.E8(LDQM)
SDRAM_DQM3: U7.F1(UDQM)

Not connected (* = marked no-connect by the designer): U7 E2(NC)*; U8 A1(NC) A2(NC) A7(NC) A8(NC) B1(NC) B7(NC) B8(NC) L1(NC) L2(NC) L7(NC) L8(NC) M1(NC) M2(NC) M7(NC) M8(NC); U9 E2(NC)*

### Buses and harness runs
bus A[22..0] = port A[22..0]
bus D[31..0] = port D[31..0]
bus SDRAM_DQM[3..0] = port SDRAM_DQM[3..0]

### Notes on the sheet
- SDRAM SIGNALS
- COMMON SIGNALS
- (near C102) FLASH SIGNALS
- LSB
- MSB
- Connect to lifted U5-88
- SDRAM
- (near U8) FLASH
- 8
- 7
- 6
- 5
- 4
- 3
- DWG. NO.
- REV.
- SHT.
- 2
- 1
- THIS DOCUMENT AND THE DATA DISCLOSED HEREIN OR HEREWITH IS THE PROPERTY OF ALTIUM LIMITED AND MAY BE FREELY DISTRIBUTED IN WHOLE. NO RIGHTS ARE RESERVED OR EXPRESS OR IMPLIED WARANTEE GIVEN.
- REVISION
- DESCRIPTION
- DATE
- APPROVED
- F
- E
- D
- C
- B
- A
- TITLE
- SCALE:
- SIZE
- CAGE CODE
- FILE NAME
- DWG NO.
- SHEET
- OF
- REV

### Library data of the parts
C102 C110 C111 = CAP-P: Polar Capacitor; Design Item Id: CAP-P-10uF-16V-MCCT-B
C103-C109 C112-C122 = CAP-NP: Capacitor
  C103 C112 C113 C118 C122: Design Item Id: CAP-NP-0.1uF-16V-0402
  C104-C109 C114-C117 C119-C121: Design Item Id: CAP-NP-10nF-16V-0402
U7 U9 = MT48LC16M16A2FG: 256Mb Synchronous High-Speed CMOS DRAM, 16Mb x 16Bit x 4 Banks, 54-Ball FPGA, Commercial; Design Item Id: MEM-SDRAM-16Mx16-BGA54
U8 = AM29LV640DU90RWHI: 64 Mb (4 M x 16) CMOS 3.0 Volt, Uniform Sector Flash Memory with VersatileI/O Control, 63-ball FBGA, Industrial Grade; Design Item Id: MEM-FLASH-P-4Mx16-BGA63

## Sheet FPGA.SchDoc: Pin Swapping
size 863 x 558 mm; DocumentNumber: 4; SheetNumber: 4; SheetTotal: 5
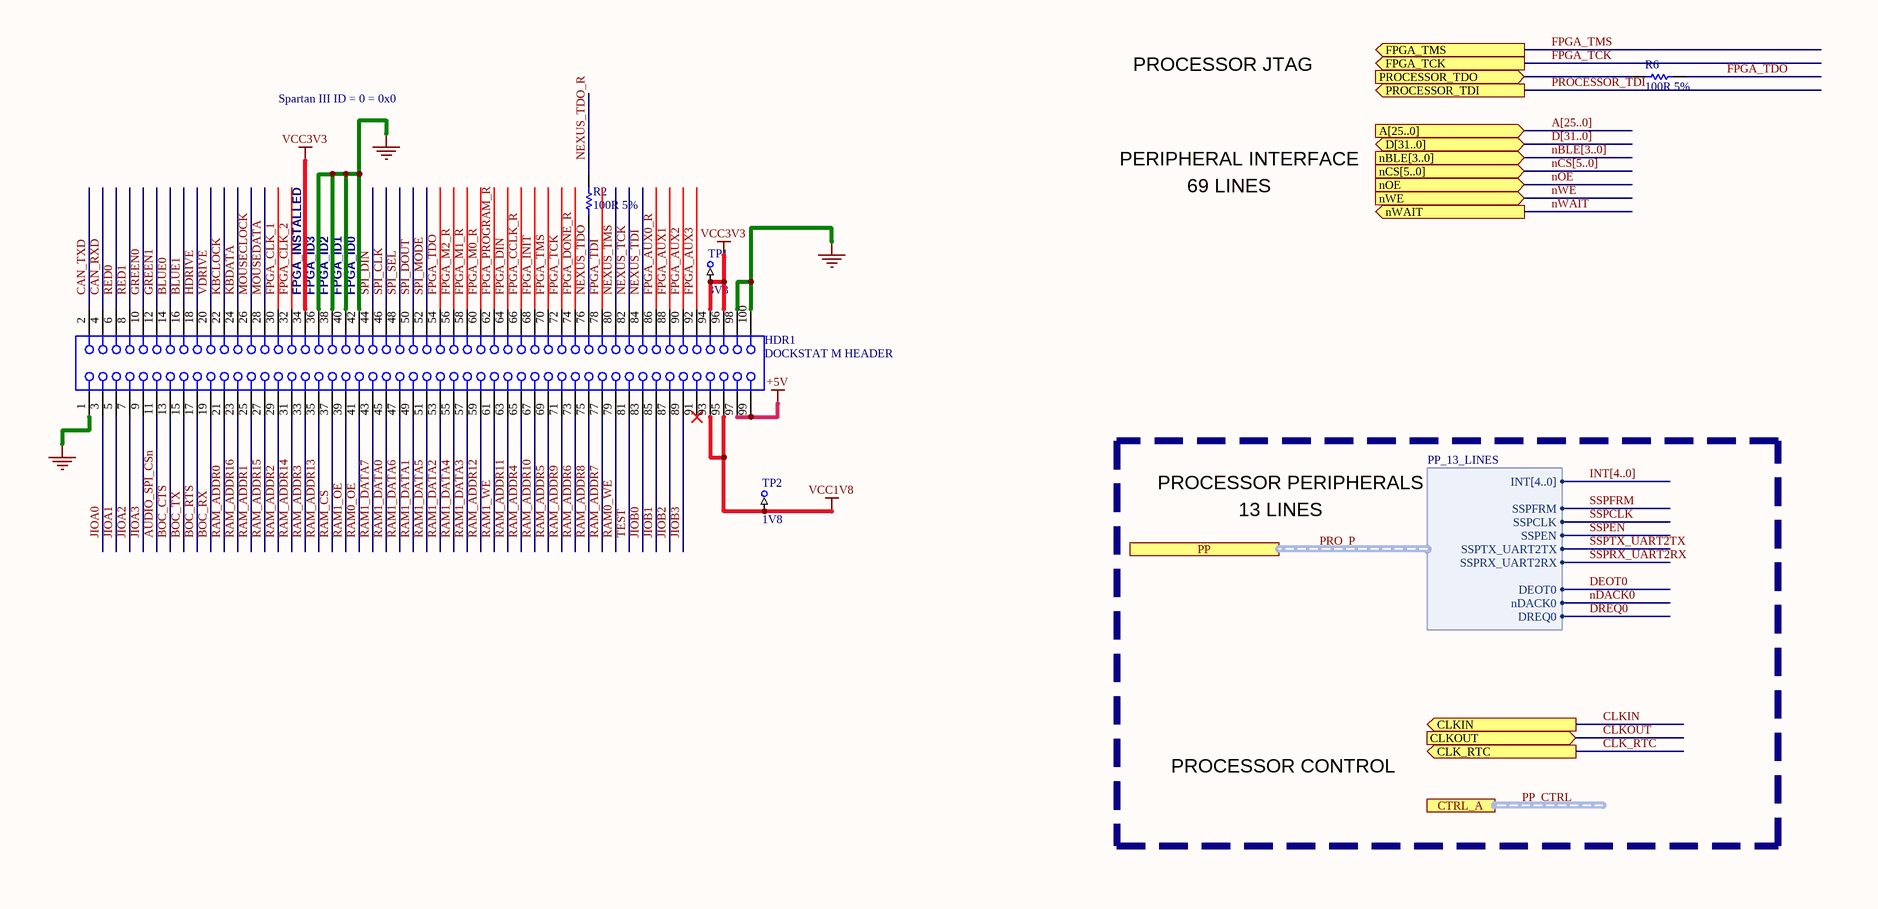
[diagram p4: FPGA.SchDoc, top left]
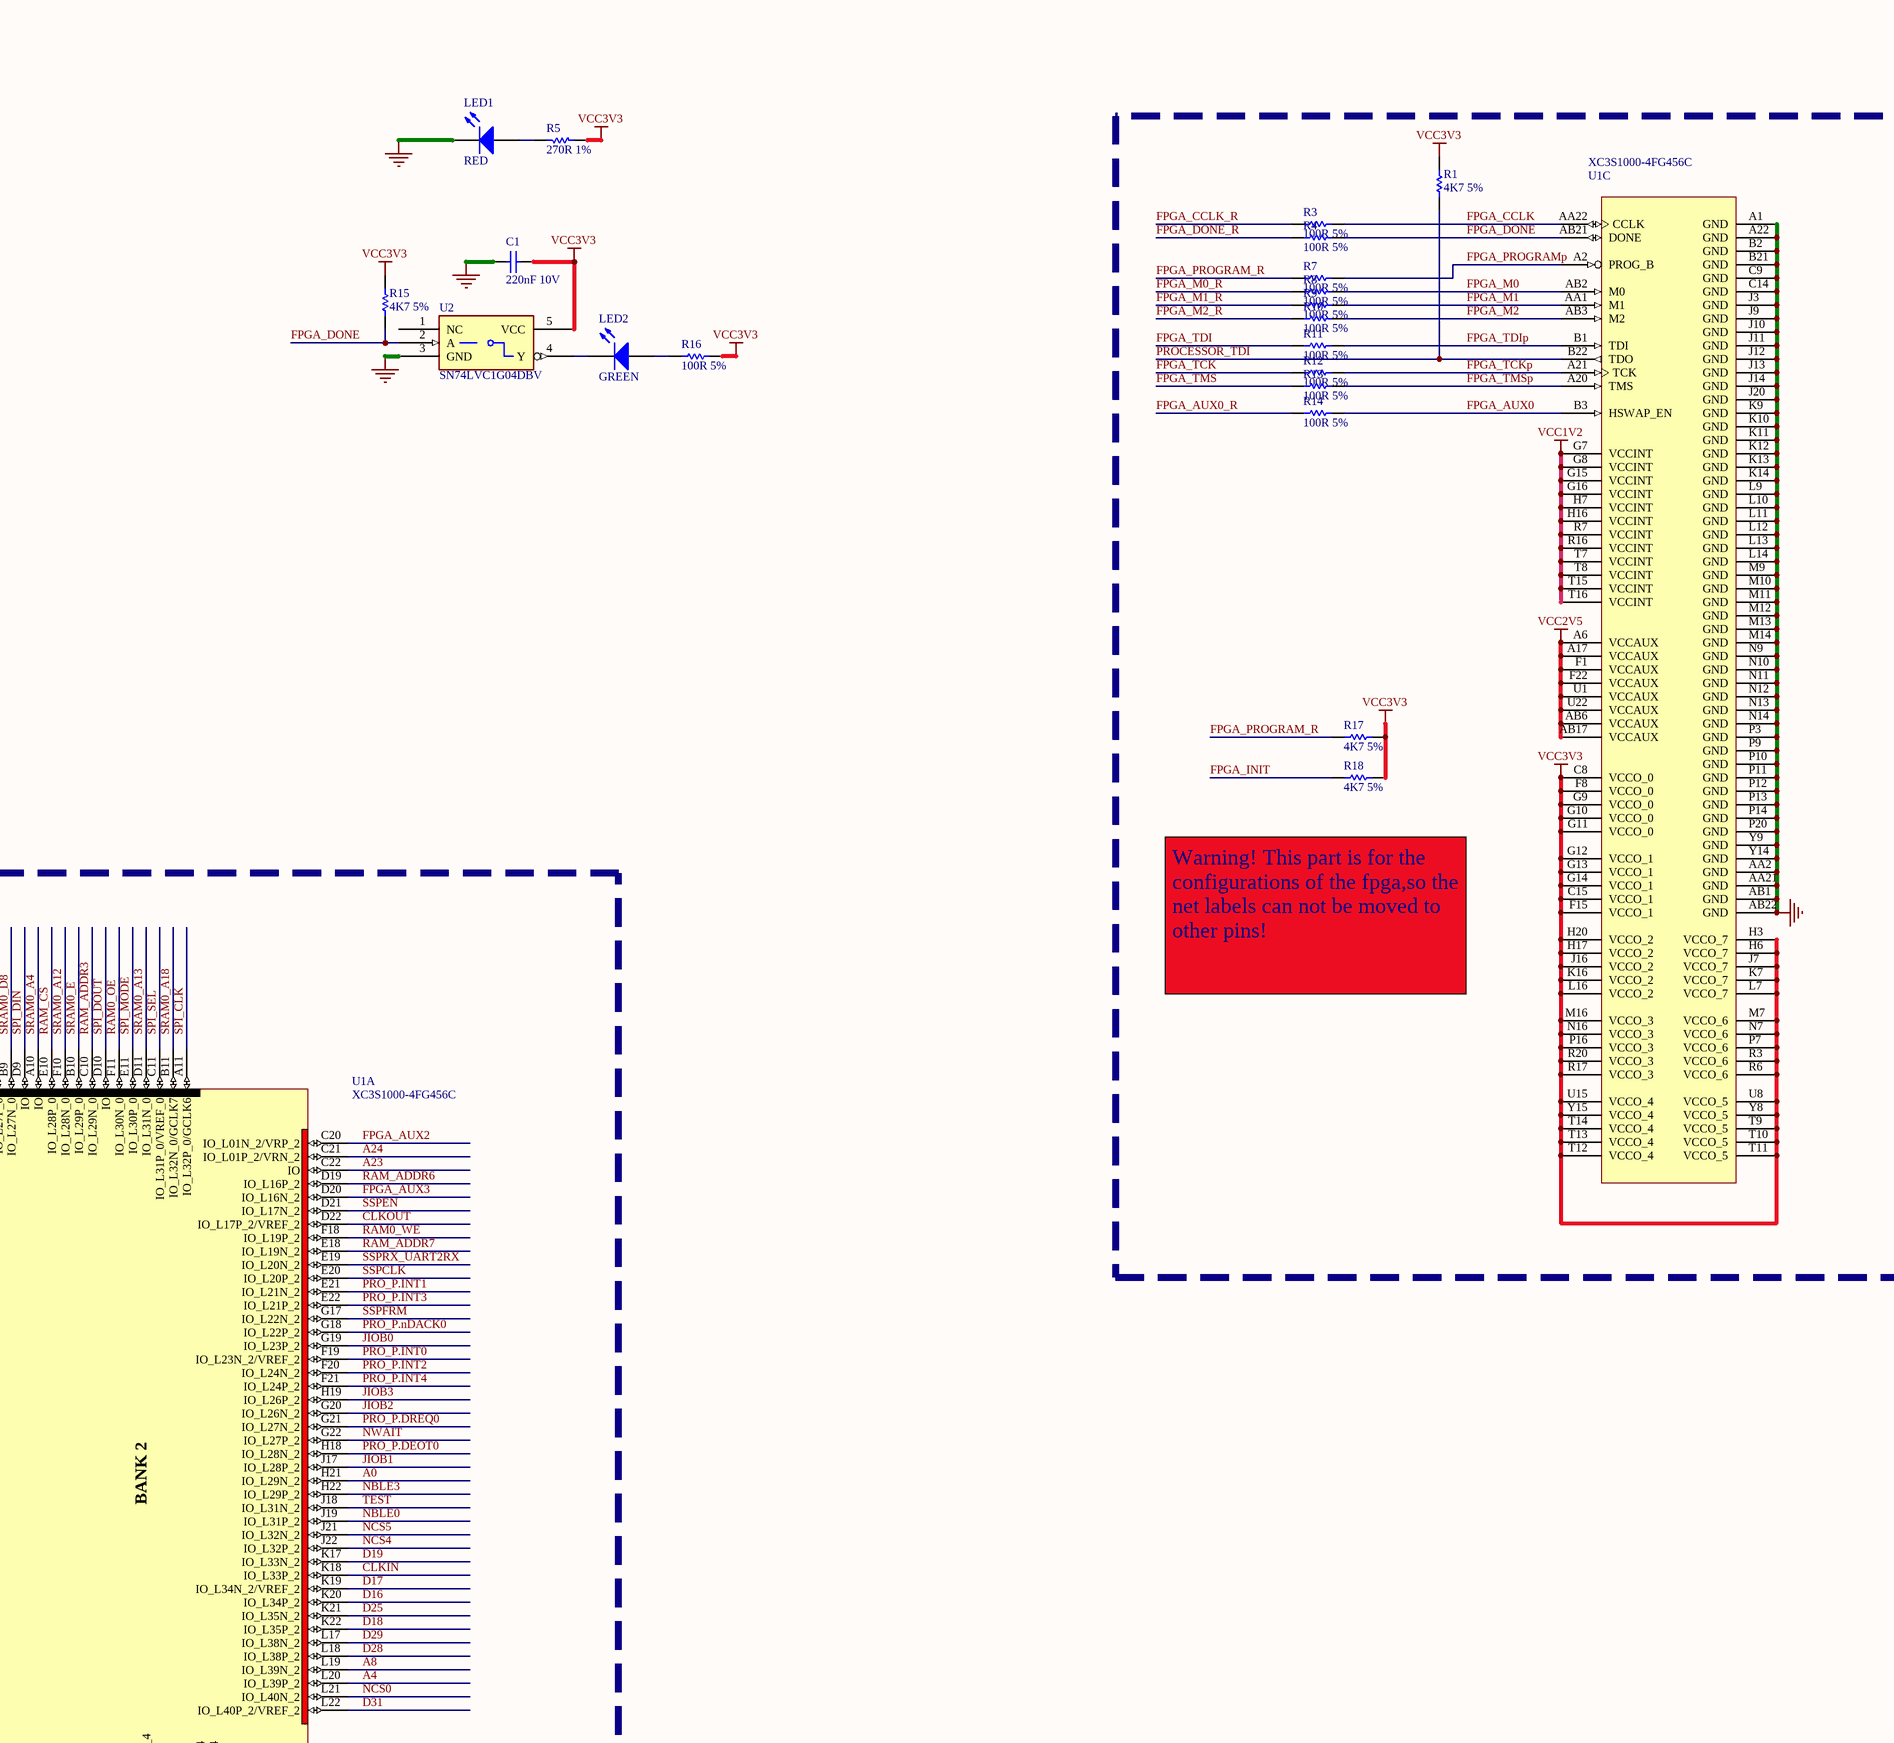
[diagram p5: FPGA.SchDoc, top right]
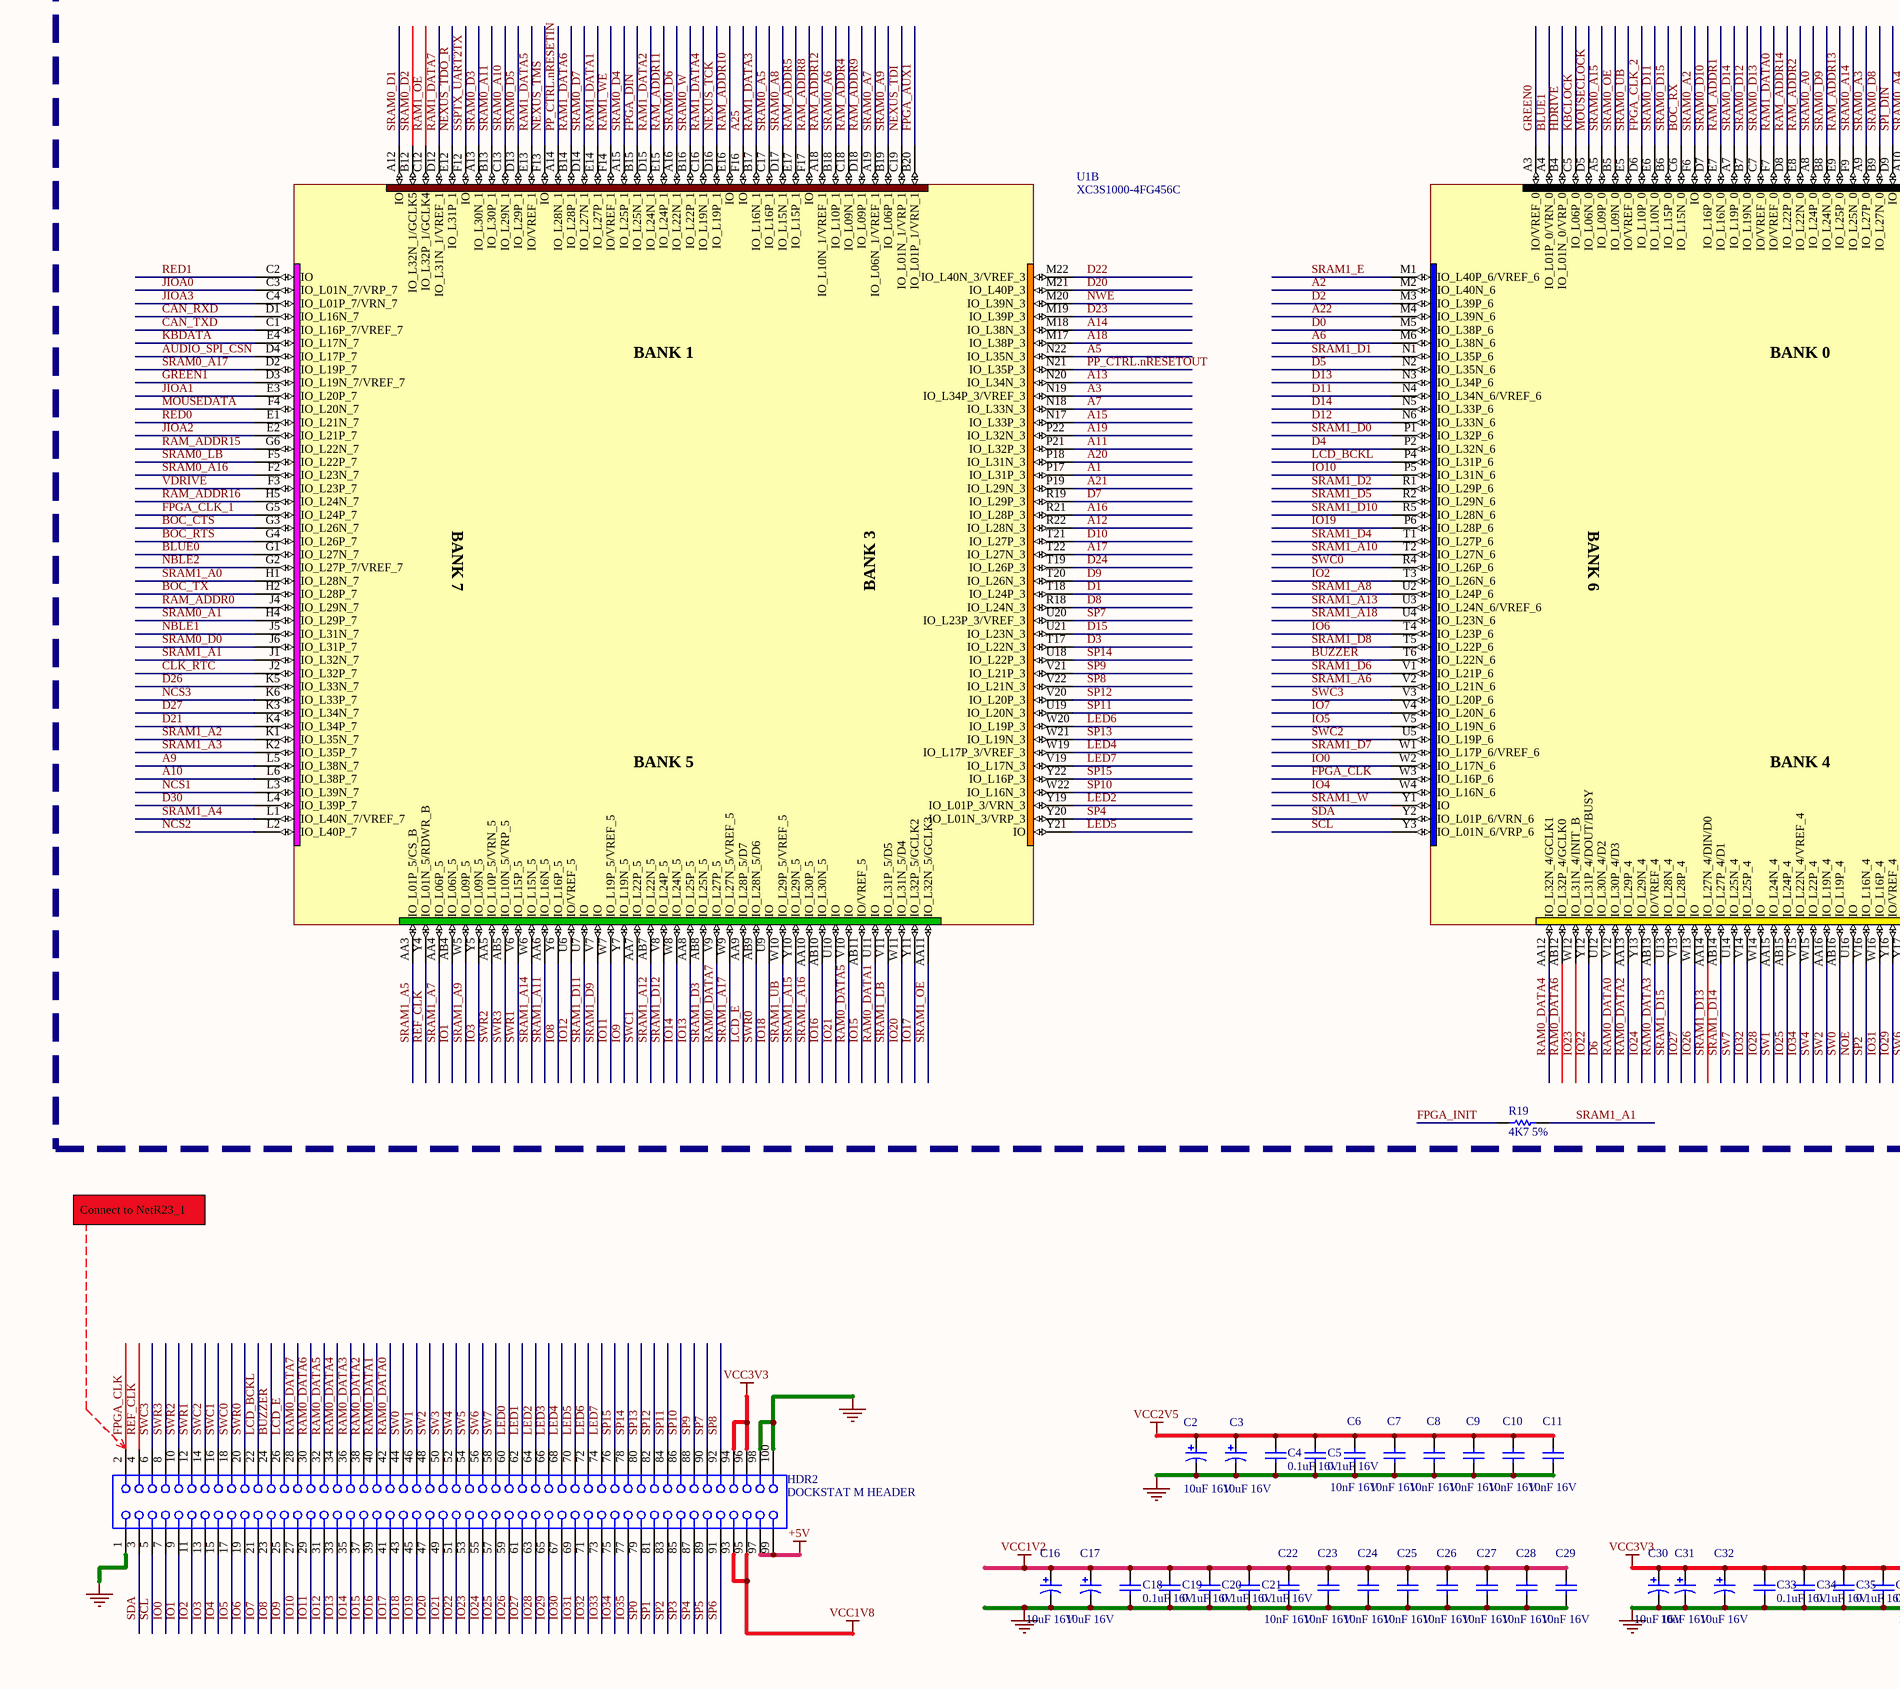
[diagram p6: FPGA.SchDoc, bottom left]
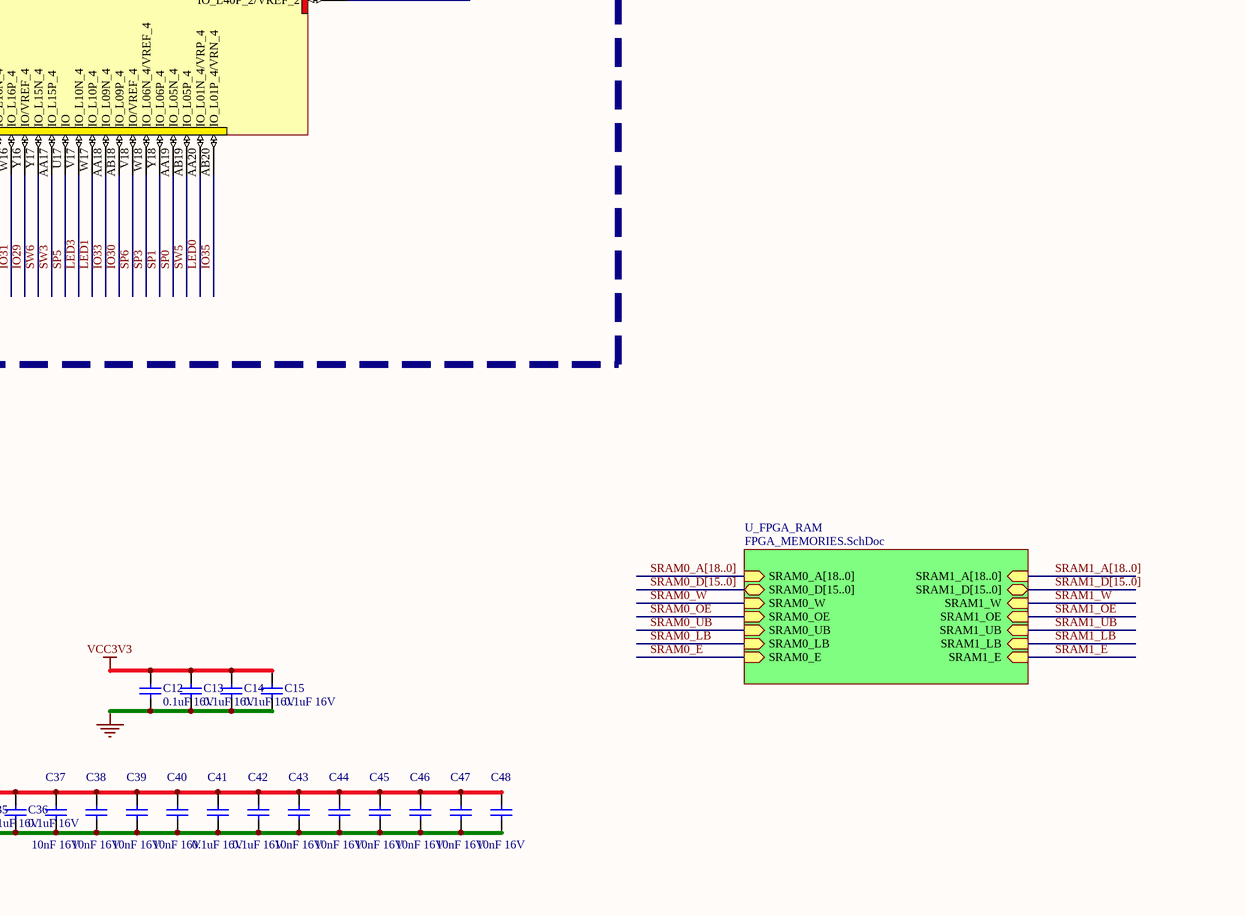
[diagram p7: FPGA.SchDoc, bottom right]

### Parts
C1  220nF 10V  [CAPC1608]
C2  10uF 16V  [CAPC3528]
C3  10uF 16V  [CAPC3528]
C4  0.1uF 16V  [CAPC1005]
C5  0.1uF 16V  [CAPC1005]
C6  10nF 16V  [CAPC1005]
C7  10nF 16V  [CAPC1005]
C8  10nF 16V  [CAPC1005]
C9  10nF 16V  [CAPC1005]
C10  10nF 16V  [CAPC1005]
C11  10nF 16V  [CAPC1005]
C12  0.1uF 16V  [CAPC1005]
C13  0.1uF 16V  [CAPC1005]
C14  0.1uF 16V  [CAPC1005]
C15  0.1uF 16V  [CAPC1005]
C16  10uF 16V  [CAPC3528]
C17  10uF 16V  [CAPC3528]
C18  0.1uF 16V  [CAPC1005]
C19  0.1uF 16V  [CAPC1005]
C20  0.1uF 16V  [CAPC1005]
C21  0.1uF 16V  [CAPC1005]
C22  10nF 16V  [CAPC1005]
C23  10nF 16V  [CAPC1005]
C24  10nF 16V  [CAPC1005]
C25  10nF 16V  [CAPC1005]
C26  10nF 16V  [CAPC1005]
C27  10nF 16V  [CAPC1005]
C28  10nF 16V  [CAPC1005]
C29  10nF 16V  [CAPC1005]
C30  10uF 16V  [CAPC3528]
C31  10uF 16V  [CAPC3528]
C32  10uF 16V  [CAPC3528]
C33  0.1uF 16V  [CAPC1005]
C34  0.1uF 16V  [CAPC1005]
C35  0.1uF 16V  [CAPC1005]
C36  0.1uF 16V  [CAPC1005]
C37  10nF 16V  [CAPC1005]
C38  10nF 16V  [CAPC1005]
C39  10nF 16V  [CAPC1005]
C40  10nF 16V  [CAPC1005]
C41  0.1uF 16V  [CAPC1005]
C42  0.1uF 16V  [CAPC1005]
C43  10nF 16V  [CAPC1005]
C44  10nF 16V  [CAPC1005]
C45  10nF 16V  [CAPC1005]
C46  10nF 16V  [CAPC1005]
C47  10nF 16V  [CAPC1005]
C48  10nF 16V  [CAPC1005]
HDR1  DOCKSTAT M HEADER  [54075]
HDR2  DOCKSTAT M HEADER  [54075]
LED1  RED  [LED2013]
LED2  GREEN  [LED2013]
R1  4K7 5%  [RESC1005]
R2  100R 5%  [RESC2012]
R3  100R 5%  [RESC2012]
R4  100R 5%  [RESC2012]
R5  270R 1%  [RESC2012]
R6  100R 5%  [RESC2012]
R7  100R 5%  [RESC2012]
R8  100R 5%  [RESC2012]
R9  100R 5%  [RESC2012]
R10  100R 5%  [RESC2012]
R11  100R 5%  [RESC2012]
R12  100R 5%  [RESC2012]
R13  100R 5%  [RESC2012]
R14  100R 5%  [RESC2012]
R15  4K7 5%  [RESC1005]
R16  100R 5%  [RESC2012]
R17  4K7 5%  [RESC1005]
R18  4K7 5%  [RESC1005]
R19  4K7 5%  [RESC1005]
TP1  3V3  [TestPin]  (no BOM)
TP2  1V8  [TestPin]  (no BOM)
U1  XC3S1000-4FG456C  [BGA100P22X22-456]  (parts A,B,C of 3)
U2  SN74LVC1G04DBV  [SOT95P280-5]

### Sub-sheets
U_FPGA_RAM = FPGA_MEMORIES.SchDoc: SRAM0_A[18..0] (in), SRAM0_D[15..0] (bidir), SRAM0_W (in), SRAM0_OE (in), SRAM0_UB (in), SRAM0_LB (in), SRAM0_E (in), SRAM1_A[18..0] (in), SRAM1_D[15..0] (bidir), SRAM1_W (in), SRAM1_OE (in), SRAM1_UB (in), SRAM1_LB (in), SRAM1_E (in)

### Ports
A[25..0] (in), CLK_RTC (out), CLKIN (out), CLKOUT (in), CTRL_A (harness P_C_HARNESS), D[31..0] (bidir), FPGA_TCK (out), FPGA_TMS (out), nBLE[3..0] (in), nCS[5..0] (in), nOE (in), nWAIT (out), nWE (in), PP (harness PP_13_LINES), PROCESSOR_TDI (out), PROCESSOR_TDO (in)

### Harnesses
PP_13_LINES: INT[4..0], SSPFRM, SSPCLK, SSPEN, SSPTX_UART2TX, SSPRX_UART2RX, DEOT0, nDACK0, DREQ0

### Nets
+5V: HDR1.97 HDR1.99 HDR2.97 HDR2.99
GND: C1.1 C2.2 C3.2 C4.2 C5.2 C6.2 C7.2 C8.2 C9.2 C10.2 C11.2 C12.2 C13.2 C14.2 C15.2 C16.2 C17.2 C18.2 C19.2 C20.2 C21.2 C22.2 C23.2 C24.2 C25.2 C26.2 C27.2 C28.2 C29.2 C30.2 C31.2 C32.2 C33.2 C34.2 C35.2 C36.2 C37.2 C38.2 C39.2 C40.2 C41.2 C42.2 C43.2 C44.2 C45.2 C46.2 C47.2 C48.2 HDR1.1 HDR1.36 HDR1.38 HDR1.40 HDR1.42 HDR1.98 HDR1.100 HDR2.1 HDR2.98 HDR2.100 LED1.2(K) U1.A1(GND) U1.A22(GND) U1.AA2(GND) U1.AA21(GND) U1.AB1(GND) U1.AB22(GND) U1.B2(GND) U1.B21(GND) U1.C9(GND) U1.C14(GND) U1.J3(GND) U1.J9(GND) U1.J10(GND) U1.J11(GND) U1.J12(GND) U1.J13(GND) U1.J14(GND) U1.J20(GND) U1.K9(GND) U1.K10(GND) U1.K11(GND) U1.K12(GND) U1.K13(GND) U1.K14(GND) U1.L9(GND) U1.L10(GND) U1.L11(GND) U1.L12(GND) U1.L13(GND) U1.L14(GND) U1.M9(GND) U1.M10(GND) U1.M11(GND) U1.M12(GND) U1.M13(GND) U1.M14(GND) U1.N9(GND) U1.N10(GND) U1.N11(GND) U1.N12(GND) U1.N13(GND) U1.N14(GND) U1.P3(GND) U1.P9(GND) U1.P10(GND) U1.P11(GND) U1.P12(GND) U1.P13(GND) U1.P14(GND) U1.P20(GND) U1.Y9(GND) U1.Y14(GND) U2.3(GND)
VCC1V2: C16.1 C17.1 C18.1 C19.1 C20.1 C21.1 C22.1 C23.1 C24.1 C25.1 C26.1 C27.1 C28.1 C29.1 U1.G7(VCCINT) U1.G8(VCCINT) U1.G15(VCCINT) U1.G16(VCCINT) U1.H7(VCCINT) U1.H16(VCCINT) U1.R7(VCCINT) U1.R16(VCCINT) U1.T7(VCCINT) U1.T8(VCCINT) U1.T15(VCCINT) U1.T16(VCCINT)
VCC1V8: HDR1.93 HDR1.95 HDR2.93 HDR2.95 TP2.1
VCC2V5: C2.1 C3.1 C4.1 C5.1 C6.1 C7.1 C8.1 C9.1 C10.1 C11.1 U1.A6(VCCAUX) U1.A17(VCCAUX) U1.AB6(VCCAUX) U1.AB17(VCCAUX) U1.F1(VCCAUX) U1.F22(VCCAUX) U1.U1(VCCAUX) U1.U22(VCCAUX)
VCC3V3: C1.2 C12.1 C13.1 C14.1 C15.1 C30.1 C31.1 C32.1 C33.1 C34.1 C35.1 C36.1 C37.1 C38.1 C39.1 C40.1 C41.1 C42.1 C43.1 C44.1 C45.1 C46.1 C47.1 C48.1 HDR1.34 HDR1.94 HDR1.96 HDR2.94 HDR2.96 R1.1 R5.1 R15.2 R16.2 R17.2 R18.2 TP1.1 U1.C8(VCCO_0) U1.C15(VCCO_1) U1.F8(VCCO_0) U1.F15(VCCO_1) U1.G9(VCCO_0) U1.G10(VCCO_0) U1.G11(VCCO_0) U1.G12(VCCO_1) U1.G13(VCCO_1) U1.G14(VCCO_1) U1.H3(VCCO_7) U1.H6(VCCO_7) U1.H17(VCCO_2) U1.H20(VCCO_2) U1.J7(VCCO_7) U1.J16(VCCO_2) U1.K7(VCCO_7) U1.K16(VCCO_2) U1.L7(VCCO_7) U1.L16(VCCO_2) U1.M7(VCCO_6) U1.M16(VCCO_3) U1.N7(VCCO_6) U1.N16(VCCO_3) U1.P7(VCCO_6) U1.P16(VCCO_3) U1.R3(VCCO_6) U1.R6(VCCO_6) U1.R17(VCCO_3) U1.R20(VCCO_3) U1.T9(VCCO_5) U1.T10(VCCO_5) U1.T11(VCCO_5) U1.T12(VCCO_4) U1.T13(VCCO_4) U1.T14(VCCO_4) U1.U8(VCCO_5) U1.U15(VCCO_4) U1.Y8(VCCO_5) U1.Y15(VCCO_4) U2.5(VCC)
A0: U1.H21(IO_L29N_2)
A1: U1.P17(IO_L31P_3)
A2: U1.M2(IO_L40N_6)
A3: U1.N19(IO_L34P_3/VREF_3)
A4: U1.L20(IO_L39P_2)
A5: U1.N22(IO_L35N_3)
A6: U1.M6(IO_L38N_6)
A7: U1.N18(IO_L33N_3)
A8: U1.L19(IO_L39N_2)
A9: U1.L5(IO_L38N_7)
A10: U1.L6(IO_L38P_7)
A11: U1.P21(IO_L32P_3)
A12: U1.R22(IO_L28N_3)
A13: U1.N20(IO_L34N_3)
A14: U1.M18(IO_L38N_3)
A15: U1.N17(IO_L33P_3)
A16: U1.R21(IO_L28P_3)
A17: U1.T22(IO_L27N_3)
A18: U1.M17(IO_L38P_3)
A19: U1.P22(IO_L32N_3)
A20: U1.P18(IO_L31N_3)
A21: U1.P19(IO_L29N_3)
A22: U1.M4(IO_L39N_6)
A23: U1.C22(IO)
A24: U1.C21(IO_L01P_2/VRN_2)
A25: U1.F16(IO)
AUDIO_SPI_CSn: HDR1.11 U1.D4(IO_L17P_7)
BLUE0: HDR1.14 U1.G1(IO_L27N_7)
BLUE1: HDR1.16 U1.A4(IO_L01P_0/VRN_0)
BOC_CTS: HDR1.13 U1.G3(IO_L26N_7)
BOC_RTS: HDR1.17 U1.G4(IO_L26P_7)
BOC_RX: HDR1.19 U1.C6(IO_L15N_0)
BOC_TX: HDR1.15 U1.H2(IO_L28P_7)
BUZZER: HDR2.24 U1.T6(IO_L22N_6)
CAN_RXD: HDR1.4 U1.D1(IO_L16N_7)
CAN_TXD: HDR1.2 U1.C1(IO_L16P_7/VREF_7)
CLK_RTC: U1.J2(IO_L32P_7) ; port CLK_RTC
CLKIN: U1.K18(IO_L33P_2) ; port CLKIN
CLKOUT: U1.D22(IO_L17P_2/VREF_2) ; port CLKOUT
D0: U1.M5(IO_L38P_6)
D1: U1.T18(IO_L24P_3)
D2: U1.M3(IO_L39P_6)
D3: U1.T17(IO_L22N_3)
D4: U1.P2(IO_L32N_6)
D5: U1.N2(IO_L35N_6)
D6: U1.U12(IO_L30N_4/D2)
D7: U1.R19(IO_L29P_3)
D8: U1.R18(IO_L24N_3)
D9: U1.T20(IO_L26N_3)
D10: U1.T21(IO_L27P_3)
D11: U1.N4(IO_L34N_6/VREF_6)
D12: U1.N6(IO_L33N_6)
D13: U1.N3(IO_L34P_6)
D14: U1.N5(IO_L33P_6)
D15: U1.U21(IO_L23N_3)
D16: U1.K20(IO_L34P_2)
D17: U1.K19(IO_L34N_2/VREF_2)
D18: U1.K22(IO_L35P_2)
D19: U1.K17(IO_L33N_2)
D20: U1.M21(IO_L40P_3)
D21: U1.K4(IO_L34P_7)
D22: U1.M22(IO_L40N_3/VREF_3)
D23: U1.M19(IO_L39P_3)
D24: U1.T19(IO_L26P_3)
D25: U1.K21(IO_L35N_2)
D26: U1.K5(IO_L33N_7)
D27: U1.K3(IO_L34N_7)
D28: U1.L18(IO_L38P_2)
D29: U1.L17(IO_L38N_2)
D30: U1.L4(IO_L39P_7)
D31: U1.L22(IO_L40P_2/VREF_2)
FPGA_AUX0: R14.1 U1.B3(HSWAP_EN)
FPGA_AUX0_R: HDR1.86 R14.2
FPGA_AUX1: HDR1.88 U1.B20(IO_L01P_1/VRN_1)
FPGA_AUX2: HDR1.90 U1.C20(IO_L01N_2/VRP_2)
FPGA_AUX3: HDR1.92 U1.D20(IO_L16N_2)
FPGA_CCLK: R3.2 U1.AA22(CCLK)
FPGA_CCLK_R: HDR1.66 R3.1
FPGA_CLK: HDR2.2 U1.W3(IO_L16P_6)
FPGA_CLK_1: HDR1.30 U1.G5(IO_L24P_7)
FPGA_CLK_2: HDR1.32 U1.D6(IO_L10P_0)
FPGA_DIN: HDR1.64 U1.B15(IO_L25N_1)
FPGA_DONE: R4.2 R15.1 U1.AB21(DONE) U2.2(A)
FPGA_DONE_R: HDR1.74 R4.1
FPGA_INIT: HDR1.68 R18.1 R19.1
FPGA_M0: R8.2 U1.AB2(M0)
FPGA_M0_R: HDR1.60 R8.1
FPGA_M1: R9.2 U1.AA1(M1)
FPGA_M1_R: HDR1.58 R9.1
FPGA_M2: R10.2 U1.AB3(M2)
FPGA_M2_R: HDR1.56 R10.1
FPGA_PROGRAM_R: HDR1.62 R7.1 R17.1
FPGA_PROGRAMp: R7.2 U1.A2(PROG_B)
FPGA_TCK: HDR1.72 R12.1 ; port FPGA_TCK
FPGA_TCKp: R12.2 U1.A21(TCK)
FPGA_TDI: HDR1.78 R11.1
FPGA_TDIp: R11.2 U1.B1(TDI)
FPGA_TDO: HDR1.54 R6.2
FPGA_TMS: HDR1.70 R13.1 ; port FPGA_TMS
FPGA_TMSp: R13.2 U1.A20(TMS)
GREEN0: HDR1.10 U1.A3(IO/VREF_0)
GREEN1: HDR1.12 U1.D3(IO_L19N_7/VREF_7)
HDRIVE: HDR1.18 U1.B4(IO_L01N_0/VRP_0)
IO0: HDR2.7 U1.W2(IO_L17N_6)
IO1: HDR2.9 U1.AB4(IO_L06N_5)
IO2: HDR2.11 U1.T3(IO_L26N_6)
IO3: HDR2.13 U1.Y5(IO_L09N_5)
IO4: HDR2.15 U1.W4(IO_L16N_6)
IO5: HDR2.17 U1.V5(IO_L19N_6)
IO6: HDR2.19 U1.T4(IO_L23P_6)
IO7: HDR2.21 U1.V4(IO_L20N_6)
IO8: HDR2.23 U1.Y6(IO_L16P_5)
IO9: HDR2.25 U1.Y7(IO_L19N_5)
IO10: HDR2.27 U1.P5(IO_L31N_6)
IO11: HDR2.29 U1.W7(IO_L19P_5/VREF_5)
IO12: HDR2.31 U1.U6(IO/VREF_5)
IO13: HDR2.33 U1.AA8(IO_L25P_5)
IO14: HDR2.35 U1.W8(IO_L24N_5)
IO15: HDR2.37 U1.AB11(IO/VREF_5)
IO16: HDR2.39 U1.AB10(IO_L30N_5)
IO17: HDR2.41 U1.Y11(IO_L32P_5/GCLK2)
IO18: HDR2.43 U1.U9(IO)
IO19: HDR2.45 U1.P6(IO_L28P_6)
IO20: HDR2.47 U1.W11(IO_L31N_5/D4)
IO21: HDR2.49 U1.U10(IO)
IO22: HDR2.51 U1.Y12(IO_L31P_4/DOUT/BUSY)
IO23: HDR2.53 U1.W12(IO_L31N_4/INIT_B)
IO24: HDR2.55 U1.Y13(IO_L29N_4)
IO25: HDR2.57 U1.AB15(IO_L24P_4)
IO26: HDR2.59 U1.W13(IO)
IO27: HDR2.61 U1.V13(IO_L28P_4)
IO28: HDR2.63 U1.W14(IO)
IO29: HDR2.65 U1.Y16(IO/VREF_4)
IO30: HDR2.67 U1.AB18(IO_L09P_4)
IO31: HDR2.69 U1.W16(IO_L16P_4)
IO32: HDR2.71 U1.V14(IO_L25P_4)
IO33: HDR2.73 U1.AA18(IO_L09N_4)
IO34: HDR2.75 U1.V15(IO_L22N_4/VREF_4)
IO35: HDR2.77 U1.AB20(IO_L01P_4/VRN_4)
JIOA0: HDR1.3 U1.C3(IO_L01N_7/VRP_7)
JIOA1: HDR1.5 U1.E3(IO_L20P_7)
JIOA2: HDR1.7 U1.E2(IO_L21P_7)
JIOA3: HDR1.9 U1.C4(IO_L01P_7/VRN_7)
JIOB0: HDR1.83 U1.G19(IO_L23P_2)
JIOB1: HDR1.85 U1.J17(IO_L28P_2)
JIOB2: HDR1.87 U1.G20(IO_L26N_2)
JIOB3: HDR1.89 U1.H19(IO_L26P_2)
KBCLOCK: HDR1.22 U1.C5(IO_L06P_0)
KBDATA: HDR1.24 U1.E4(IO_L17N_7)
LCD_BCKL: HDR2.22 U1.P4(IO_L31P_6)
LCD_E: HDR2.26 U1.AA9(IO_L28P_5/D7)
LED0: HDR2.60 U1.AA20(IO_L01N_4/VRP_4)
LED1: HDR2.62 U1.W17(IO_L10P_4)
LED2: HDR2.64 U1.Y19(IO_L01P_3/VRN_3)
LED3: HDR2.66 U1.V17(IO_L10N_4)
LED4: HDR2.68 U1.W19(IO_L17P_3/VREF_3)
LED5: HDR2.70 U1.Y21(IO)
LED6: HDR2.72 U1.W20(IO_L19P_3)
LED7: HDR2.74 U1.V19(IO_L17N_3)
MOUSECLOCK: HDR1.26 U1.D5(IO_L06N_0)
MOUSEDATA: HDR1.28 U1.F4(IO_L20N_7)
nBLE0: U1.J19(IO_L31P_2)
nBLE1: U1.J5(IO_L31N_7)
nBLE2: U1.G2(IO_L27P_7/VREF_7)
nBLE3: U1.H22(IO_L29P_2)
nCS0: U1.L21(IO_L40N_2)
nCS1: U1.L3(IO_L39N_7)
nCS2: U1.L2(IO_L40P_7)
nCS3: U1.K6(IO_L33P_7)
nCS4: U1.J22(IO_L32P_2)
nCS5: U1.J21(IO_L32N_2)
NEXUS_TCK: HDR1.82 U1.D16(IO_L19P_1)
NEXUS_TDI: HDR1.84 U1.C19(IO_L01N_1/VRP_1)
NEXUS_TDO: HDR1.76 R2.1
NEXUS_TDO_R: R2.2 U1.E12(IO_L31P_1)
NEXUS_TMS: HDR1.80 U1.F13(IO)
nOE: U1.U16(IO) ; port nOE
nWAIT: U1.G22(IO_L27P_2) ; port nWAIT
nWE: U1.M20(IO_L39N_3) ; port nWE
PP_CTRL.nRESETIN: U1.A14(IO_L28N_1)
PP_CTRL.nRESETOUT: U1.N21(IO_L35P_3)
PRO_P.DEOT0: U1.H18(IO_L28N_2)
PRO_P.DREQ0: U1.G21(IO_L27N_2)
PRO_P.INT0: U1.F19(IO_L23N_2/VREF_2)
PRO_P.INT1: U1.E21(IO_L21N_2)
PRO_P.INT2: U1.F20(IO_L24N_2)
PRO_P.INT3: U1.E22(IO_L21P_2)
PRO_P.INT4: U1.F21(IO_L24P_2)
PRO_P.nDACK0: U1.G18(IO_L22P_2)
PROCESSOR_TDI: R1.2 U1.B22(TDO) ; port PROCESSOR_TDI
PROCESSOR_TDO: R6.1 ; port PROCESSOR_TDO
RAM0_DATA0: HDR2.42 U1.V12(IO_L30P_4/D3)
RAM0_DATA1: HDR2.40 U1.U11(IO)
RAM0_DATA2: HDR2.38 U1.AA13(IO_L29P_4)
RAM0_DATA3: HDR2.36 U1.AB13(IO/VREF_4)
RAM0_DATA4: HDR2.34 U1.AA12(IO_L32N_4/GCLK1)
RAM0_DATA5: HDR2.32 U1.V10(IO)
RAM0_DATA6: HDR2.30 U1.AB12(IO_L32P_4/GCLK0)
RAM0_DATA7: HDR2.28 U1.V9(IO_L27P_5)
RAM0_OE: HDR1.41 U1.F11(IO_L30N_0)
RAM0_WE: HDR1.79 U1.F18(IO_L19P_2)
RAM1_DATA0: HDR1.45 U1.F7(IO/VREF_0)
RAM1_DATA1: HDR1.49 U1.E14(IO_L27P_1)
RAM1_DATA2: HDR1.53 U1.D15(IO_L24N_1)
RAM1_DATA3: HDR1.57 U1.B17(IO_L16N_1)
RAM1_DATA4: HDR1.55 U1.C16(IO_L19N_1)
RAM1_DATA5: HDR1.51 U1.E13(IO/VREF_1)
RAM1_DATA6: HDR1.47 U1.B14(IO_L28P_1)
RAM1_DATA7: HDR1.43 U1.D12(IO_L31N_1/VREF_1)
RAM1_OE: HDR1.39 U1.C12(IO_L32P_1/GCLK4)
RAM1_WE: HDR1.61 U1.F14(IO/VREF_1)
RAM_ADDR0: HDR1.21 U1.J4(IO_L29N_7)
RAM_ADDR1: HDR1.25 U1.E7(IO_L16N_0)
RAM_ADDR2: HDR1.29 U1.E8(IO_L22N_0)
RAM_ADDR3: HDR1.33 U1.C10(IO_L29N_0)
RAM_ADDR4: HDR1.65 U1.C18(IO_L09N_1)
RAM_ADDR5: HDR1.69 U1.E17(IO_L15P_1)
RAM_ADDR6: HDR1.73 U1.D19(IO_L16P_2)
RAM_ADDR7: HDR1.77 U1.E18(IO_L19N_2)
RAM_ADDR8: HDR1.75 U1.F17(IO)
RAM_ADDR9: HDR1.71 U1.D18(IO_L09P_1)
RAM_ADDR10: HDR1.67 U1.E16(IO)
RAM_ADDR11: HDR1.63 U1.E15(IO_L24P_1)
RAM_ADDR12: HDR1.59 U1.A18(IO_L10N_1/VREF_1)
RAM_ADDR13: HDR1.35 U1.E9(IO_L25P_0)
RAM_ADDR14: HDR1.31 U1.D8(IO_L22P_0)
RAM_ADDR15: HDR1.27 U1.G6(IO_L22N_7)
RAM_ADDR16: HDR1.23 U1.H5(IO_L24N_7)
RAM_CS: HDR1.37 U1.E10(IO_L28P_0)
RED0: HDR1.6 U1.E1(IO_L21N_7)
RED1: HDR1.8 U1.C2(IO)
REF_CLK: HDR2.4 U1.Y4(IO_L01N_5/RDWR_B)
SCL: HDR2.5 U1.Y3(IO_L01N_6/VRP_6)
SDA: HDR2.3 U1.Y2(IO_L01P_6/VRN_6)
SP0: HDR2.79 U1.AA19(IO_L05N_4)
SP1: HDR2.81 U1.Y18(IO_L06P_4)
SP2: HDR2.83 U1.V16(IO_L16N_4)
SP3: HDR2.85 U1.W18(IO_L06N_4/VREF_4)
SP4: HDR2.87 U1.Y20(IO_L01N_3/VRP_3)
SP5: HDR2.89 U1.U17(IO)
SP6: HDR2.91 U1.V18(IO/VREF_4)
SP7: HDR2.90 U1.U20(IO_L23P_3/VREF_3)
SP8: HDR2.92 U1.V22(IO_L21N_3)
SP9: HDR2.88 U1.V21(IO_L21P_3)
SP10: HDR2.86 U1.W22(IO_L16N_3)
SP11: HDR2.84 U1.U19(IO_L20N_3)
SP12: HDR2.82 U1.V20(IO_L20P_3)
SP13: HDR2.80 U1.W21(IO_L19N_3)
SP14: HDR2.78 U1.U18(IO_L22P_3)
SP15: HDR2.76 U1.Y22(IO_L16P_3)
SPI_CLK: HDR1.46 U1.A11(IO_L32P_0/GCLK6)
SPI_DIN: HDR1.44 U1.D9(IO)
SPI_DOUT: HDR1.50 U1.D10(IO)
SPI_MODE: HDR1.52 U1.E11(IO_L30P_0)
SPI_SEL: HDR1.48 U1.C11(IO_L31P_0/VREF_0)
SRAM0_A0: U1.A8(IO_L24P_0)
SRAM0_A1: U1.H4(IO_L29P_7)
SRAM0_A2: U1.F6(IO)
SRAM0_A3: U1.A9(IO_L27P_0)
SRAM0_A4: U1.A10(IO)
SRAM0_A5: U1.C17(IO_L16P_1)
SRAM0_A6: U1.B18(IO_L10P_1)
SRAM0_A7: U1.A19(IO_L06N_1/VREF_1)
SRAM0_A8: U1.D17(IO_L15N_1)
SRAM0_A9: U1.B19(IO_L06P_1)
SRAM0_A10: U1.C13(IO_L29N_1)
SRAM0_A11: U1.B13(IO_L30P_1)
SRAM0_A12: U1.F10(IO_L28N_0)
SRAM0_A13: U1.D11(IO_L31N_0)
SRAM0_A14: U1.F9(IO_L25N_0)
SRAM0_A15: U1.A5(IO_L09P_0)
SRAM0_A16: U1.F2(IO_L23N_7)
SRAM0_A17: U1.D2(IO_L19P_7)
SRAM0_A18: U1.B11(IO_L32N_0/GCLK7)
SRAM0_D0: U1.J6(IO_L31P_7)
SRAM0_D1: U1.A12(IO)
SRAM0_D2: U1.B12(IO_L32N_1/GCLK5)
SRAM0_D3: U1.A13(IO_L30N_1)
SRAM0_D4: U1.A15(IO_L25P_1)
SRAM0_D5: U1.D13(IO_L29P_1)
SRAM0_D6: U1.A16(IO_L22N_1)
SRAM0_D7: U1.D14(IO_L27N_1)
SRAM0_D8: U1.B9(IO_L27N_0)
SRAM0_D9: U1.B8(IO_L24N_0)
SRAM0_D10: U1.D7(IO_L16P_0)
SRAM0_D11: U1.E6(IO_L10N_0)
SRAM0_D12: U1.B7(IO_L19N_0)
SRAM0_D13: U1.C7(IO/VREF_0)
SRAM0_D14: U1.A7(IO_L19P_0)
SRAM0_D15: U1.B6(IO_L15P_0)
SRAM0_E: U1.B10(IO_L29P_0) ; sheet U_FPGA_RAM/SRAM0_E
SRAM0_LB: U1.F5(IO_L22P_7) ; sheet U_FPGA_RAM/SRAM0_LB
SRAM0_OE: U1.B5(IO_L09N_0) ; sheet U_FPGA_RAM/SRAM0_OE
SRAM0_UB: U1.E5(IO/VREF_0) ; sheet U_FPGA_RAM/SRAM0_UB
SRAM0_W: U1.B16(IO_L22P_1) ; sheet U_FPGA_RAM/SRAM0_W
SRAM1_A0: U1.H1(IO_L28N_7)
SRAM1_A1: R19.2 U1.J1(IO_L32N_7)
SRAM1_A2: U1.K1(IO_L35N_7)
SRAM1_A3: U1.K2(IO_L35P_7)
SRAM1_A4: U1.L1(IO_L40N_7/VREF_7)
SRAM1_A5: U1.AA3(IO_L01P_5/CS_B)
SRAM1_A6: U1.V2(IO_L21N_6)
SRAM1_A7: U1.AA4(IO_L06P_5)
SRAM1_A8: U1.U2(IO_L24P_6)
SRAM1_A9: U1.W5(IO_L09P_5)
SRAM1_A10: U1.T2(IO_L27N_6)
SRAM1_A11: U1.AA6(IO_L16N_5)
SRAM1_A12: U1.AB7(IO_L22N_5)
SRAM1_A13: U1.U3(IO_L24N_6/VREF_6)
SRAM1_A14: U1.W6(IO_L15N_5)
SRAM1_A15: U1.Y10(IO_L29N_5)
SRAM1_A16: U1.AA10(IO_L30P_5)
SRAM1_A17: U1.W9(IO_L27N_5/VREF_5)
SRAM1_A18: U1.U4(IO_L23N_6)
SRAM1_D0: U1.P1(IO_L32P_6)
SRAM1_D1: U1.N1(IO_L35P_6)
SRAM1_D2: U1.R1(IO_L29P_6)
SRAM1_D3: U1.AB8(IO_L25N_5)
SRAM1_D4: U1.T1(IO_L27P_6)
SRAM1_D5: U1.R2(IO_L29N_6)
SRAM1_D6: U1.V1(IO_L21P_6)
SRAM1_D7: U1.W1(IO_L17P_6/VREF_6)
SRAM1_D8: U1.T5(IO_L22P_6)
SRAM1_D9: U1.V7(IO)
SRAM1_D10: U1.R5(IO_L28N_6)
SRAM1_D11: U1.U7(IO)
SRAM1_D12: U1.V8(IO_L24P_5)
SRAM1_D13: U1.AA14(IO_L27N_4/DIN/D0)
SRAM1_D14: U1.AB14(IO_L27P_4/D1)
SRAM1_D15: U1.U13(IO_L28N_4)
SRAM1_E: U1.M1(IO_L40P_6/VREF_6) ; sheet U_FPGA_RAM/SRAM1_E
SRAM1_LB: U1.V11(IO_L31P_5/D5) ; sheet U_FPGA_RAM/SRAM1_LB
SRAM1_OE: U1.AA11(IO_L32N_5/GCLK3) ; sheet U_FPGA_RAM/SRAM1_OE
SRAM1_UB: U1.W10(IO_L29P_5/VREF_5) ; sheet U_FPGA_RAM/SRAM1_UB
SRAM1_W: U1.Y1(IO) ; sheet U_FPGA_RAM/SRAM1_W
SSPCLK: U1.E20(IO_L20P_2) ; port PP.SSPCLK  [project net PRO_P.SSPCLK]
SSPEN: U1.D21(IO_L17N_2) ; port PP.SSPEN  [project net PRO_P.SSPEN]
SSPFRM: U1.G17(IO_L22N_2) ; port PP.SSPFRM  [project net PRO_P.SSPFRM]
SSPRX_UART2RX: U1.E19(IO_L20N_2) ; port PP.SSPRX_UART2RX  [project net PRO_P.SSPRX_UART2RX]
SSPTX_UART2TX: U1.F12(IO) ; port PP.SSPTX_UART2TX  [project net PRO_P.SSPTX_UART2TX]
SW0: HDR2.44 U1.AB16(IO_L19P_4)
SW1: HDR2.46 U1.AA15(IO_L24N_4)
SW2: HDR2.48 U1.AA16(IO_L19N_4)
SW3: HDR2.50 U1.AA17(IO_L15P_4)
SW4: HDR2.52 U1.W15(IO_L22P_4)
SW5: HDR2.54 U1.AB19(IO_L05P_4)
SW6: HDR2.56 U1.Y17(IO_L15N_4)
SW7: HDR2.58 U1.U14(IO_L25N_4)
SWC0: HDR2.18 U1.R4(IO_L26P_6)
SWC1: HDR2.16 U1.AA7(IO_L22P_5)
SWC2: HDR2.14 U1.U5(IO_L19P_6)
SWC3: HDR2.6 U1.V3(IO_L20P_6)
SWR0: HDR2.20 U1.AB9(IO_L28N_5/D6)
SWR1: HDR2.12 U1.V6(IO_L15P_5)
SWR2: HDR2.10 U1.AA5(IO_L10P_5/VRN_5)
SWR3: HDR2.8 U1.AB5(IO_L10N_5/VRP_5)
TEST: HDR1.81 U1.J18(IO_L31N_2)
VDRIVE: HDR1.20 U1.F3(IO_L23P_7)
NetLED1_1: LED1.1(A) R5.2
NetLED2_1: LED2.1(A) R16.1
NetLED2_2: LED2.2(K) U2.4(Y)

Not connected (* = marked no-connect by the designer): HDR1 91*; U2 1(NC)

### Buses and harness runs
bus A[25..0] = port A[25..0]
bus D[31..0] = port D[31..0]
bus INT[4..0]
bus nBLE[3..0] = port nBLE[3..0]
bus nCS[5..0] = port nCS[5..0]
bus SRAM0_A[18..0] = sheet U_FPGA_RAM/SRAM0_A[18..0]
bus SRAM0_D[15..0] = sheet U_FPGA_RAM/SRAM0_D[15..0]
bus SRAM1_A[18..0] = sheet U_FPGA_RAM/SRAM1_A[18..0]
bus SRAM1_D[15..0] = sheet U_FPGA_RAM/SRAM1_D[15..0]
harness PP_CTRL = port CTRL_A
harness PRO_P = port PP

### Notes on the sheet
- PROCESSOR JTAG
- Spartan III ID = 0 = 0x0
- PERIPHERAL INTERFACE
- 69 LINES
- (near HDR1) FPGA_INSTALLED
- (near HDR1) FPGA_ID3
- (near HDR1) FPGA_ID2
- (near HDR1) FPGA_ID1
- (near HDR1) FPGA_ID0
- PROCESSOR PERIPHERALS
- 13 LINES
- PROCESSOR CONTROL
- Warning! This part is for the configurations of the fpga,so the net labels can not be moved to other pins!
- Connect to NetR23_1
- 12
- 11
- 10
- 9
- 8
- 7
- 6
- 5
- 4
- 3
- DWG. NO.
- 2
- 1
- REV.
- SHT.
- REVISION
- DESCRIPTION
- DATE
- APPROVED
- J
- THIS DOCUMENT AND THE DATA DISCLOSED HEREIN OR HEREWITH IS THE PROPERTY OF ALTIUM LIMITED AND MAY BE FREELY DISTRIBUTED IN WHOLE. NO RIGHTS ARE RESERVED OR EXPRESS OR IMPLIED WARANTEE GIVEN.
- I
- H
- G
- F
- E
- D
- C
- B
- A
- TITLE
- SCALE:
- SIZE
- CAGE CODE
- FILE NAME
- DWG NO.
- SHEET
- OF
- REV
- (in symbol XC3S1000-4FG456C, part A) BANK 0; BANK 6; BANK 2; BANK 4
- (in symbol XC3S1000-4FG456C, part B) BANK 1; BANK 7; BANK 3; BANK 5

### Library data of the parts
C1 = CAP-NP-220nF-10V-0603: Capacitor; Design Item Id: CAP-NP-220nF-10V-0603
C2 C3 C16 C17 C30-C32 = CAP-P-10uF-16V-MCCT-B: Polar Capacitor; Design Item Id: CAP-P-10uF-16V-MCCT-B
C4 C5 C12-C15 C18-C21 C33-C36 C41 C42 = CAP-NP-0.1uF-16V-0402: Capacitor; Design Item Id: CAP-NP-0.1uF-16V-0402
C6-C11 C22-C29 C37-C40 C43-C48 = CAP-NP-10nF-16V-0402: Capacitor; Design Item Id: CAP-NP-10nF-16V-0402
HDR1 HDR2 = CON-DOCKSTAT-M-0.8mm: Board-to-Board, Docking Station, 0.80mm (.031") Pitch, Shielded Receptacle, Vertical, Ultra Low Profile, SMT; Design Item Id: CON-DOCKSTAT-M-0.8mm
LED1 = LED-RED-HSMHC170: Typical GREEN SMD LED Agilent make; Design Item Id: LED-RED-HSMHC170
LED2 = LED-GRN-HSMHC170: Typical GREEN SMD LED Agilent make; Design Item Id: LED-GRN-HSMHC170
R1 R15 R17-R19 = RES-4K7-0402: Resistor; Design Item Id: RES-4K7-0402
R2-R4 R6-R14 R16 = RES-100R-0805: Resistor; Design Item Id: RES-100R-0805
R5 = RES-270R-1%-0805: Resistor; Design Item Id: RES-270R-1%-0805
TP1 TP2 = TestPin: Design Item Id: TestPin
U1 = XC3S1000-4FG456C: Spartan-3 1.2V FPGA, 333 User I/Os, 456-ball FBGA, Standard Performance, Commercial Grade; Design Item Id: XC3S1000-4FG456C
U2 = SN74LVC1G04DBV: Design Item Id: SN74LVC1G04DBV

## Sheet FPGA_MEMORIES.SchDoc: Pin Swapping
size 431 x 279 mm; DocumentNumber: 5; SheetNumber: 5; SheetTotal: 6
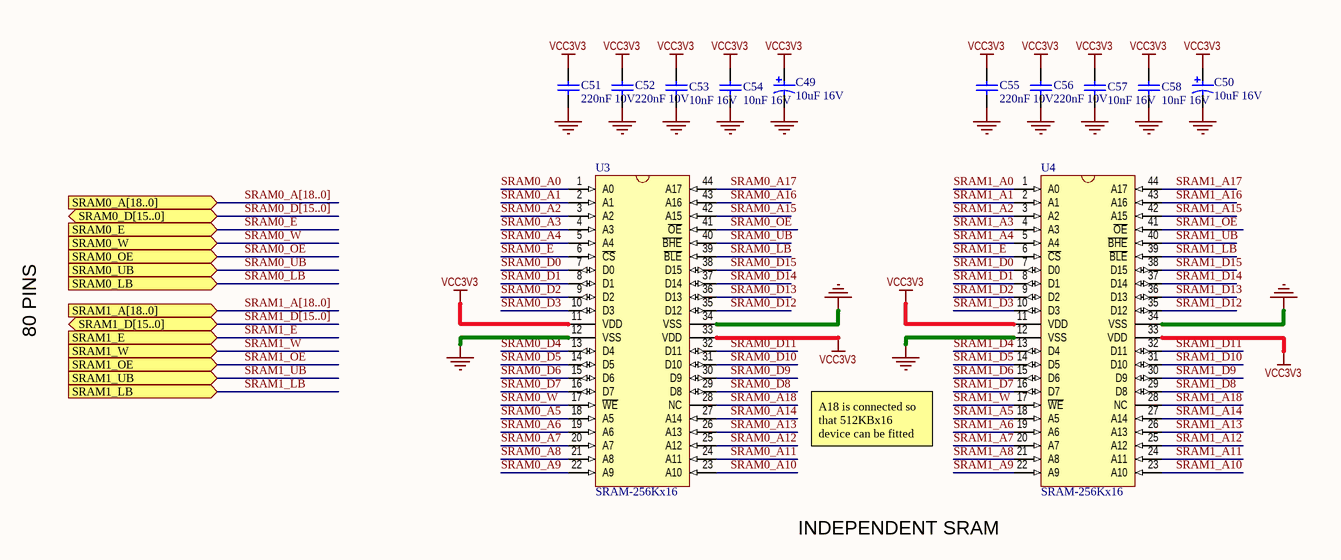
[diagram p8: FPGA_MEMORIES.SchDoc]

### Parts
C49  10uF 16V  [CAPC3528]
C50  10uF 16V  [CAPC3528]
C51  220nF 10V  [CAPC1608]
C52  220nF 10V  [CAPC1608]
C53  10nF 16V  [CAPC1005]
C54  10nF 16V  [CAPC1005]
C55  220nF 10V  [CAPC1608]
C56  220nF 10V  [CAPC1608]
C57  10nF 16V  [CAPC1005]
C58  10nF 16V  [CAPC1005]
U3  SRAM-256Kx16  [TSOP80P1176-44]
U4  SRAM-256Kx16  [TSOP80P1176-44]

### Ports
SRAM0_A[18..0] (in), SRAM0_D[15..0] (bidir), SRAM0_E (in), SRAM0_LB (in), SRAM0_OE (in), SRAM0_UB (in), SRAM0_W (in), SRAM1_A[18..0] (in), SRAM1_D[15..0] (bidir), SRAM1_E (in), SRAM1_LB (in), SRAM1_OE (in), SRAM1_UB (in), SRAM1_W (in)

### Nets
GND: C49.2 C50.2 C51.2 C52.2 C53.2 C54.2 C55.2 C56.2 C57.2 C58.2 U3.12(VSS) U3.34(VSS) U4.12(VSS) U4.34(VSS)
VCC3V3: C49.1 C50.1 C51.1 C52.1 C53.1 C54.1 C55.1 C56.1 C57.1 C58.1 U3.11(VDD) U3.33(VDD) U4.11(VDD) U4.33(VDD)
SRAM0_A0: U3.1(A0)
SRAM0_A1: U3.2(A1)
SRAM0_A2: U3.3(A2)
SRAM0_A3: U3.4(A3)
SRAM0_A4: U3.5(A4)
SRAM0_A5: U3.18(A5)
SRAM0_A6: U3.19(A6)
SRAM0_A7: U3.20(A7)
SRAM0_A8: U3.21(A8)
SRAM0_A9: U3.22(A9)
SRAM0_A10: U3.23(A10)
SRAM0_A11: U3.24(A11)
SRAM0_A12: U3.25(A12)
SRAM0_A13: U3.26(A13)
SRAM0_A14: U3.27(A14)
SRAM0_A15: U3.42(A15)
SRAM0_A16: U3.43(A16)
SRAM0_A17: U3.44(A17)
SRAM0_A18: U3.28(NC)
SRAM0_D0: U3.7(D0)
SRAM0_D1: U3.8(D1)
SRAM0_D2: U3.9(D2)
SRAM0_D3: U3.10(D3)
SRAM0_D4: U3.13(D4)
SRAM0_D5: U3.14(D5)
SRAM0_D6: U3.15(D6)
SRAM0_D7: U3.16(D7)
SRAM0_D8: U3.29(D8)
SRAM0_D9: U3.30(D9)
SRAM0_D10: U3.31(D10)
SRAM0_D11: U3.32(D11)
SRAM0_D12: U3.35(D12)
SRAM0_D13: U3.36(D13)
SRAM0_D14: U3.37(D14)
SRAM0_D15: U3.38(D15)
SRAM0_E: U3.6(~{CS}) ; port SRAM0_E
SRAM0_LB: U3.39(~{BLE}) ; port SRAM0_LB
SRAM0_OE: U3.41(~{OE}) ; port SRAM0_OE
SRAM0_UB: U3.40(~{BHE}) ; port SRAM0_UB
SRAM0_W: U3.17(~{WE}) ; port SRAM0_W
SRAM1_A0: U4.1(A0)
SRAM1_A1: U4.2(A1)
SRAM1_A2: U4.3(A2)
SRAM1_A3: U4.4(A3)
SRAM1_A4: U4.5(A4)
SRAM1_A5: U4.18(A5)
SRAM1_A6: U4.19(A6)
SRAM1_A7: U4.20(A7)
SRAM1_A8: U4.21(A8)
SRAM1_A9: U4.22(A9)
SRAM1_A10: U4.23(A10)
SRAM1_A11: U4.24(A11)
SRAM1_A12: U4.25(A12)
SRAM1_A13: U4.26(A13)
SRAM1_A14: U4.27(A14)
SRAM1_A15: U4.42(A15)
SRAM1_A16: U4.43(A16)
SRAM1_A17: U4.44(A17)
SRAM1_A18: U4.28(NC)
SRAM1_D0: U4.7(D0)
SRAM1_D1: U4.8(D1)
SRAM1_D2: U4.9(D2)
SRAM1_D3: U4.10(D3)
SRAM1_D4: U4.13(D4)
SRAM1_D5: U4.14(D5)
SRAM1_D6: U4.15(D6)
SRAM1_D7: U4.16(D7)
SRAM1_D8: U4.29(D8)
SRAM1_D9: U4.30(D9)
SRAM1_D10: U4.31(D10)
SRAM1_D11: U4.32(D11)
SRAM1_D12: U4.35(D12)
SRAM1_D13: U4.36(D13)
SRAM1_D14: U4.37(D14)
SRAM1_D15: U4.38(D15)
SRAM1_E: U4.6(~{CS}) ; port SRAM1_E
SRAM1_LB: U4.39(~{BLE}) ; port SRAM1_LB
SRAM1_OE: U4.41(~{OE}) ; port SRAM1_OE
SRAM1_UB: U4.40(~{BHE}) ; port SRAM1_UB
SRAM1_W: U4.17(~{WE}) ; port SRAM1_W

### Buses and harness runs
bus SRAM0_A[18..0] = port SRAM0_A[18..0]
bus SRAM0_D[15..0] = port SRAM0_D[15..0]
bus SRAM1_A[18..0] = port SRAM1_A[18..0]
bus SRAM1_D[15..0] = port SRAM1_D[15..0]

### Notes on the sheet
- 80 PINS
- A18 is connected so that 512KBx16 device can be fitted
- INDEPENDENT SRAM
- 8
- 7
- 6
- 5
- 4
- 3
- DWG. NO.
- REV.
- SHT.
- 2
- 1
- THIS DOCUMENT AND THE DATA DISCLOSED HEREIN OR HEREWITH IS THE PROPERTY OF ALTIUM LIMITED AND MAY BE FREELY DISTRIBUTED IN WHOLE. NO RIGHTS ARE RESERVED OR EXPRESS OR IMPLIED WARANTEE GIVEN.
- REVISION
- DESCRIPTION
- DATE
- APPROVED
- F
- E
- D
- C
- B
- A
- TITLE
- SCALE:
- SIZE
- CAGE CODE
- FILE NAME
- DWG NO.
- SHEET
- OF
- REV

### Library data of the parts
C49 C50 = CAP-P: Polar Capacitor; Design Item Id: CAP-P-10uF-16V-MCCT-B
C51-C58 = CAP-NP: Capacitor
  C51 C52 C55 C56: Design Item Id: CAP-NP-220nF-10V-0603
  C53 C54 C57 C58: Design Item Id: CAP-NP-10nF-16V-0402
U3 U4 = K6R4016V1D-T: 256Kx16Bit SRAM TSOP44; Design Item Id: MEM-SRAM-256Kx16-TSOP44